# Altium project OBC.PrjPcb
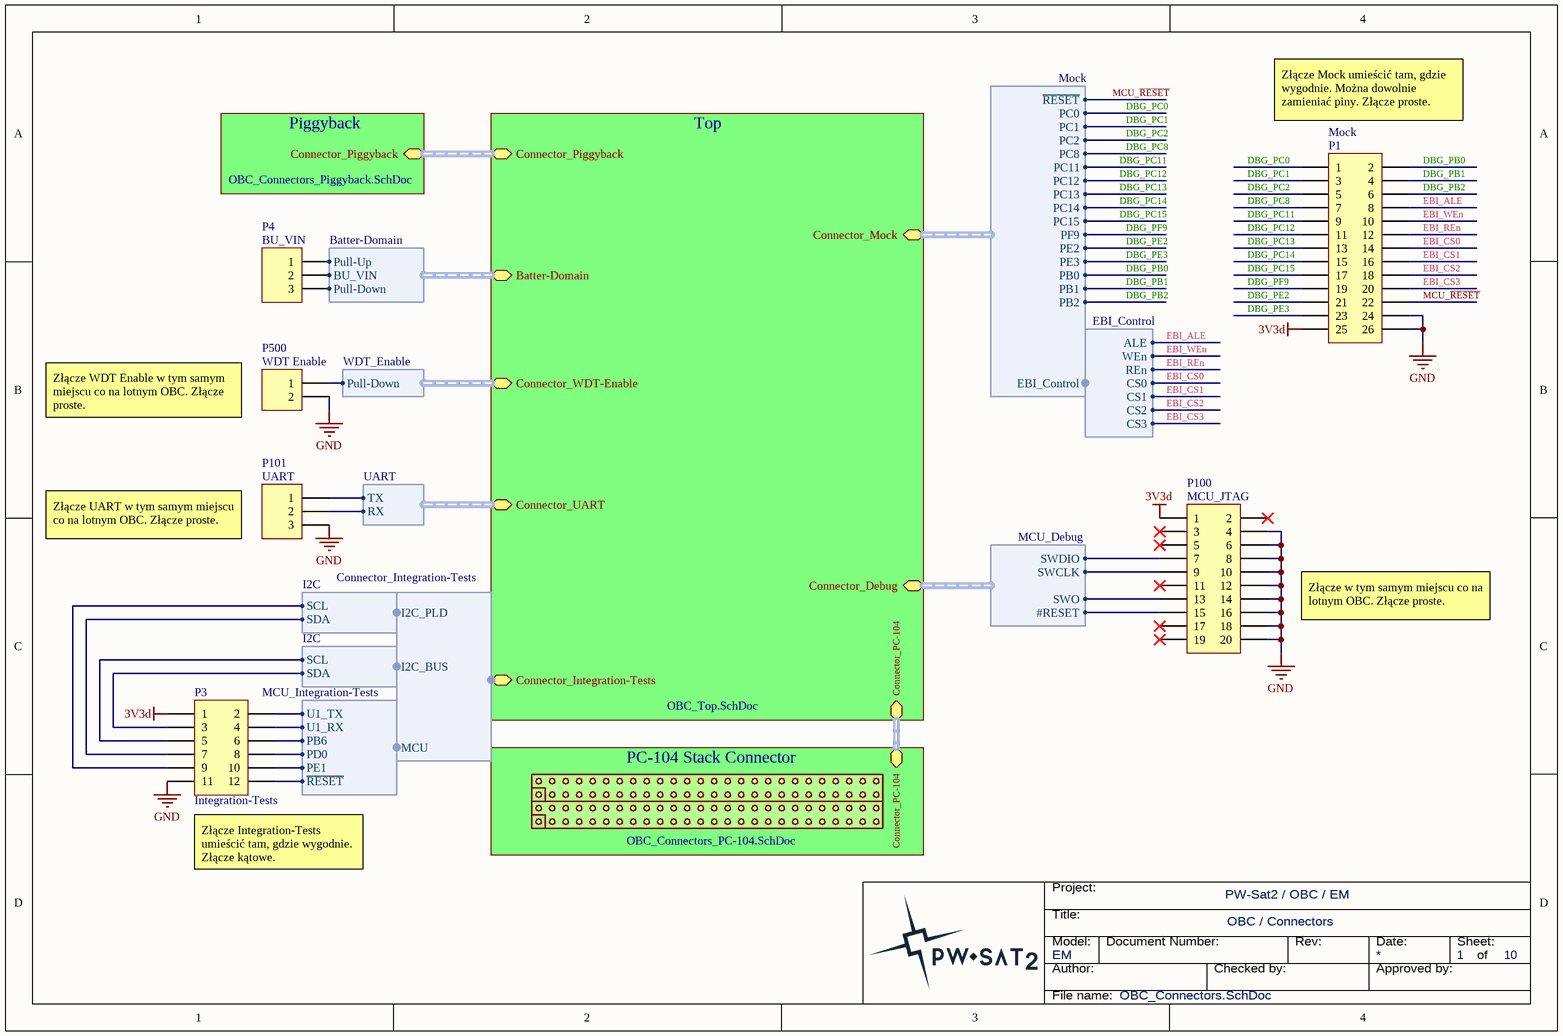
[diagram p0: OBC_Connectors.SchDoc]
Subsystem: OBC; Schematics_Revision: 2; Schematics_DocNo: PWSat2-xxx-DW-xxx; Schematics_DocName: OBC; Project_ShortName: PW-Sat2; Project_FullName: PW-Sat2; PCB_Revision: 2; PCB_DocNo: PWSat2-xxx-DW-xxx; PCB_CheckedBy: (not checked); PCB_Author: (pcbdoc author); Model: EM; Equipment: OBC; CheckedBy_Name: Grzegorz Gajoch; Author_Name: Piotr Kuligowski; ApprovedBy_Name: (not approved)
10 sheets, 98 parts. Net scope: hierarchical (ports join the sheet entries above them; power ports are global).
Board file: OBC.PcbDoc
Sheets:
  OBC_Connectors.SchDoc
    Top = OBC_Top.SchDoc
      EEPROM = OBC_EEPROM.SchDoc
      Flash = OBC_Flash.SchDoc
      SRAM = OBC_SRAM.SchDoc
      MCU = OBC_MCU.SchDoc
      I2C-Repeater = OBC_I2C-Repeater.SchDoc
      I2C-Repeater = OBC_I2C-Repeater.SchDoc
      D-Latch = OBC_EBI_D-Latch.SchDoc
    Piggyback = OBC_Connectors_Piggyback.SchDoc
    PC-104 Stack Connector = OBC_Connectors_PC-104.SchDoc

## Sheet OBC_Connectors.SchDoc: Connectors
size A4; ApprovedBy: (not approved); CheckedBy: Grzegorz Gajoch; Author: Piotr Kuligowski; DocumentNumber: PWSat2-xxx-DW-xxx; Revision: 2; SheetNumber: 1; SheetTotal: 10; Model: EM

### Parts
P1  Mock  [Samtec_TSW-113-07-L-D]
P3  Integration-Tests  [Samtec_TSW-106-07-L-D]
P4  BU_VIN  [Samtec_TSW-103-07-L-S]
P100  MCU_JTAG  [Samtec_TSS-110-01-G-D]
P101  UART  [Samtec_TSW-103-07-L-S]
P500  WDT Enable  [HEADER 1X2 Male]

### Sub-sheets
PC-104 Stack Connector = OBC_Connectors_PC-104.SchDoc: Connector_PC-104 (harness Connector_PC-104)
Piggyback = OBC_Connectors_Piggyback.SchDoc: Connector_Piggyback (harness Connector_Piggyback)
Top = OBC_Top.SchDoc: Connector_UART (harness UART), Connector_PC-104 (harness Connector_PC-104), Connector_Piggyback (harness Connector_Piggyback), Connector_Debug (harness MCU_Debug), Connector_Mock (harness Mock), Connector_Integration-Tests (harness Connector_Integration-Tests), Connector_WDT-Enable (harness WDT_Enable), Batter-Domain (harness Batter-Domain)

### Harnesses
UART: RX, TX
MCU_Debug: SWDIO, SWCLK, SWO, #RESET
Mock: PC14, PC15, PF9, PE2, PE3, PB0, PB1, PB2, EBI_Control, PC0, PC1, PC2, PC8, ~{RESET}, PC11, PC12, PC13
EBI_Control: ALE, WEn, REn, CS0, CS1, CS2, CS3
Connector_Integration-Tests: MCU, I2C_PLD, I2C_BUS
I2C: SDA, SCL
MCU_Integration-Tests: ~{RESET}, PB6, PD0, PE1, U1_TX, U1_RX
WDT_Enable: Pull-Down
Batter-Domain: BU_VIN, Pull-Up, Pull-Down

### Nets
3V3d: P1.25 P3.1 P100.1
GND: P1.24 P1.26 P3.11 P100.4 P100.6 P100.8 P100.10 P100.12 P100.14 P100.16 P100.18 P100.20 P101.3 P500.2
DBG_PB0: P1.2 ; sheet Top/Connector_Mock.PB0
DBG_PB1: P1.4 ; sheet Top/Connector_Mock.PB1
DBG_PB2: P1.6 ; sheet Top/Connector_Mock.PB2
DBG_PC0: P1.1 ; sheet Top/Connector_Mock.PC0
DBG_PC1: P1.3 ; sheet Top/Connector_Mock.PC1
DBG_PC2: P1.5 ; sheet Top/Connector_Mock.PC2
DBG_PC8: P1.7 ; sheet Top/Connector_Mock.PC8
DBG_PC11: P1.9 ; sheet Top/Connector_Mock.PC11
DBG_PC12: P1.11 ; sheet Top/Connector_Mock.PC12
DBG_PC13: P1.13 ; sheet Top/Connector_Mock.PC13
DBG_PC14: P1.15 ; sheet Top/Connector_Mock.PC14
DBG_PC15: P1.17 ; sheet Top/Connector_Mock.PC15
DBG_PE2: P1.21 ; sheet Top/Connector_Mock.PE2
DBG_PE3: P1.23 ; sheet Top/Connector_Mock.PE3
DBG_PF9: P1.19 ; sheet Top/Connector_Mock.PF9
EBI_ALE: P1.8 ; harness EBI_Control.ALE
EBI_CS0: P1.14 ; harness EBI_Control.CS0
EBI_CS1: P1.16 ; harness EBI_Control.CS1
EBI_CS2: P1.18 ; harness EBI_Control.CS2
EBI_CS3: P1.20 ; harness EBI_Control.CS3
EBI_REn: P1.12 ; harness EBI_Control.REn
EBI_WEn: P1.10 ; harness EBI_Control.WEn
GPIO_PD8: P4.2 ; sheet Top/Batter-Domain.BU_VIN
Intergation_PB6: P3.6 ; harness MCU_Integration-Tests.PB6
Intergation_PD0: P3.8 ; harness MCU_Integration-Tests.PD0
Intergation_PE1: P3.10 ; harness MCU_Integration-Tests.PE1
MCU_~{RESET}: P1.22 P3.12 P100.15 ; sheet Top/Connector_Debug.#RESET, sheet Top/Connector_Mock.~{RESET}, harness MCU_Integration-Tests.~{RESET}
MCU_SWCLK: P100.9 ; sheet Top/Connector_Debug.SWCLK
MCU_SWDIO: P100.7 ; sheet Top/Connector_Debug.SWDIO
MCU_SWO: P100.13 ; sheet Top/Connector_Debug.SWO
PC-104_I2C-Bus_SCL: P3.5 ; harness I2C.SCL
PC-104_I2C-Bus_SDA: P3.3 ; harness I2C.SDA
PC-104_I2C-Payload_SCL: P3.9 ; harness I2C.SCL
PC-104_I2C-Payload_SDA: P3.7 ; harness I2C.SDA
U1_RX: P3.4 P101.2 ; sheet Top/Connector_UART.RX, harness MCU_Integration-Tests.U1_RX
U1_TX: P3.2 P101.1 ; sheet Top/Connector_UART.TX, harness MCU_Integration-Tests.U1_TX
NetP4_1: P4.1 ; sheet Top/Batter-Domain.Pull-Up
NetP4_3: P4.3 ; sheet Top/Batter-Domain.Pull-Down
NetP500_1: P500.1 ; sheet Top/Connector_WDT-Enable.Pull-Down

Not connected (* = marked no-connect by the designer): P100 2* 3* 5* 11* 17* 19*

### Buses and harness runs
harness sheet PC-104 Stack Connector/Connector_PC-104 = sheet Top/Connector_PC-104
harness sheet Piggyback/Connector_Piggyback = sheet Top/Connector_Piggyback

### Notes on the sheet
- (near P1) Złącze Mock umieścić tam, gdzie wygodnie. Można dowolnie zamieniać piny. Złącze proste.
- Złącze WDT Enable w tym samym miejscu co na lotnym OBC. Złącze proste.
- Złącze UART w tym samym miejscu co na lotnym OBC. Złącze proste.
- Złącze w tym samym miejscu co na lotnym OBC. Złącze proste.
- (near P3) Złącze Integration-Tests umieścić tam, gdzie wygodnie. Złącze kątowe.
- Title:
- Project:
- Author:
- Model:
- Document Number:
- Checked by:
- Rev:
- Date:
- Approved by:
- Sheet:
- of
- File name:

### Library data of the parts
P1 = Header 13X2: Header, 13-Pin, Dual row; partNo: 67997-426HLF; Manufacturer: Amphenol; Supplier 1: Farnell; Farnell: 1925216
P3 = Header 6X2: Header, 6-Pin, Dual row, Right Angle; partNo: MC34771; Manufacturer: Multicomp; Supplier 1: Farnell; Farnell: 1593452
P4 P101 = Header 3: Header, 3-Pin; partNo: 2211S-03G; Manufacturer: Multicomp; Supplier 1: Farnell; Farnell: 1593412
P100 = Header 10X2: Header, 10-Pin, Dual row; partNo: MC9A12-2034; Manufacturer: 3M; Supplier 1: Farnell; Farnell: 1099258
P500 = Header 2: Header, 2-Pin; Manufacturer: Multicomp; partNo: 2211S-02G; Farnell: 1593411; Supplier 1: Farnell

## Sheet OBC_Top.SchDoc: Top
size A4; ApprovedBy: (not approved); CheckedBy: Grzegorz Gajoch; Author: Piotr Kuligowski; DocumentNumber: PWSat2-xxx-DW-xxx; Revision: 2; SheetNumber: 4; SheetTotal: 10; Model: EM
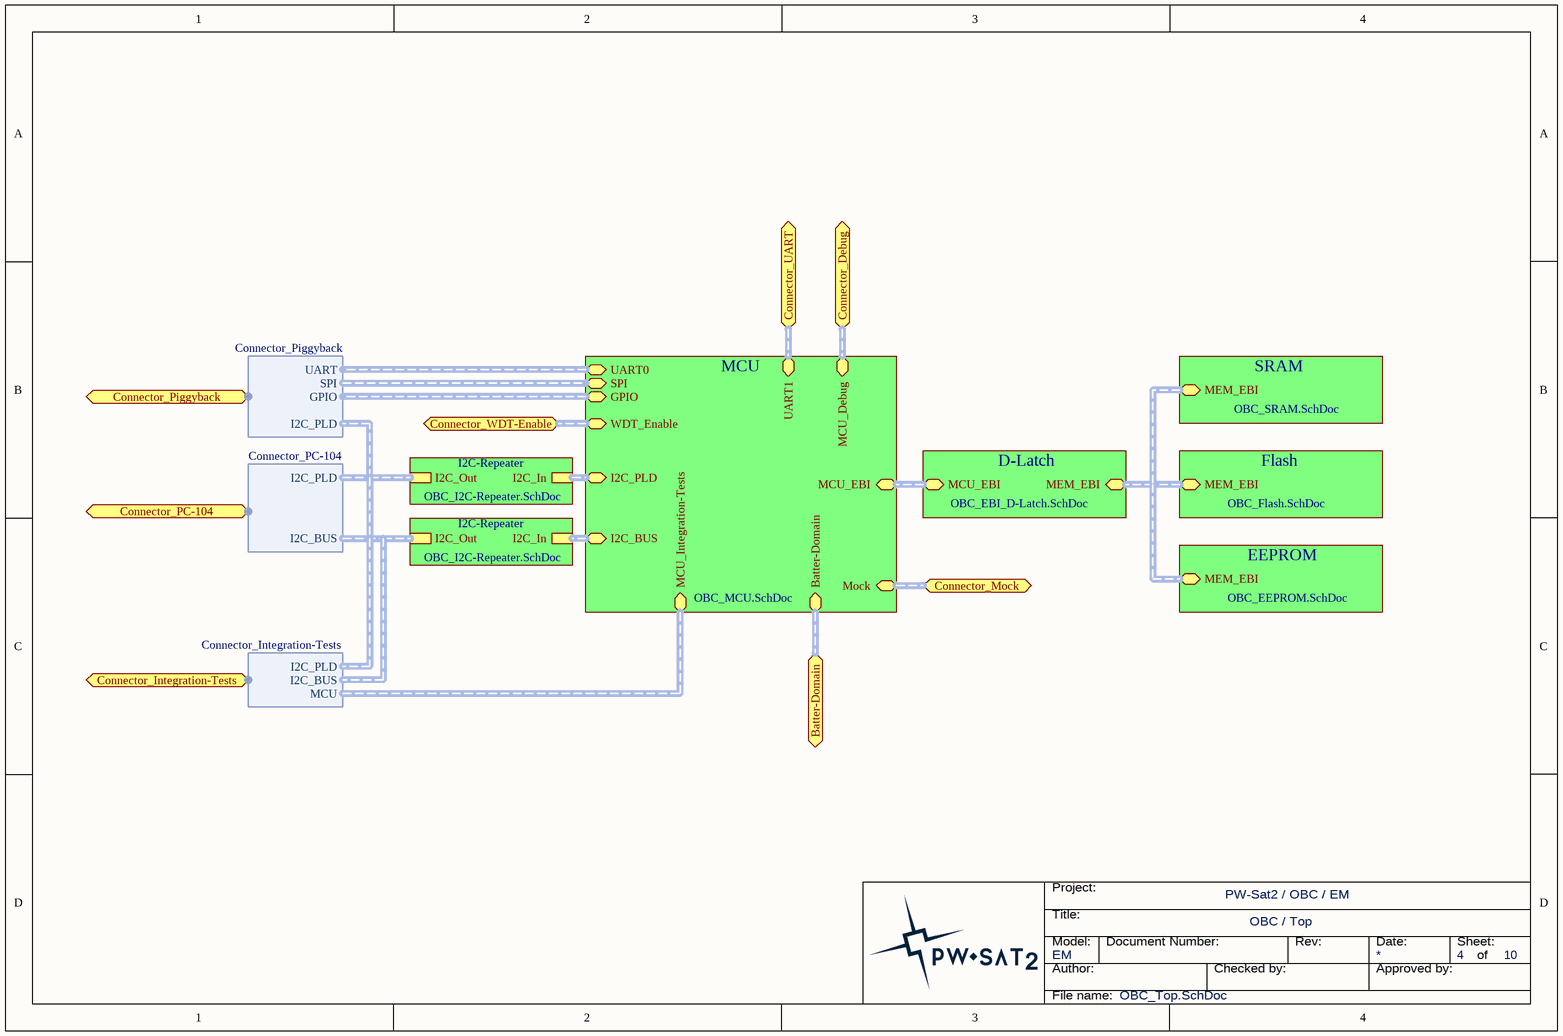
[diagram p1: OBC_Top.SchDoc]

### Sub-sheets
D-Latch = OBC_EBI_D-Latch.SchDoc: MEM_EBI (harness MEM_EBI), MCU_EBI (harness MCU_EBI)
EEPROM = OBC_EEPROM.SchDoc: MEM_EBI (harness MEM_EBI)
Flash = OBC_Flash.SchDoc: MEM_EBI (harness MEM_EBI)
I2C-Repeater = OBC_I2C-Repeater.SchDoc: I2C_Out (harness I2C), I2C_In (harness I2C)
I2C-Repeater = OBC_I2C-Repeater.SchDoc: I2C_Out (harness I2C), I2C_In (harness I2C)
MCU = OBC_MCU.SchDoc: I2C_BUS (harness I2C), I2C_PLD (harness I2C), UART0 (harness UART), SPI (harness SPI), UART1 (harness UART), GPIO (harness GPIO), Mock (harness Mock), MCU_Debug (harness MCU_Debug), MCU_EBI (harness MCU_EBI), MCU_Integration-Tests (harness MCU_Integration-Tests), WDT_Enable (harness WDT_Enable), Batter-Domain (harness Batter-Domain)
SRAM = OBC_SRAM.SchDoc: MEM_EBI (harness MEM_EBI)

### Ports
Batter-Domain (harness Batter-Domain), Connector_Debug (harness MCU_Debug), Connector_Integration-Tests (harness Connector_Integration-Tests), Connector_Mock (harness Mock), Connector_PC-104 (harness Connector_PC-104), Connector_Piggyback (harness Connector_Piggyback), Connector_UART (harness UART), Connector_WDT-Enable (harness WDT_Enable)

### Harnesses
Connector_Piggyback: UART, SPI, I2C_PLD, GPIO
Connector_PC-104: I2C_BUS, I2C_PLD
Connector_Integration-Tests: MCU, I2C_PLD, I2C_BUS

### Buses and harness runs
harness port Batter-Domain = sheet MCU/Batter-Domain
harness port Connector_Debug = sheet MCU/MCU_Debug
harness port Connector_Mock = sheet MCU/Mock
harness port Connector_UART = sheet MCU/UART1
harness port Connector_WDT-Enable = sheet MCU/WDT_Enable
harness sheet D-Latch/MCU_EBI = sheet MCU/MCU_EBI
harness sheet D-Latch/MEM_EBI = sheet EEPROM/MEM_EBI = sheet Flash/MEM_EBI = sheet SRAM/MEM_EBI
harness sheet I2C-Repeater/I2C_In = sheet MCU/I2C_BUS
harness sheet I2C-Repeater/I2C_In = sheet MCU/I2C_PLD

### Notes on the sheet
- Title:
- Project:
- Author:
- Model:
- Document Number:
- Checked by:
- Rev:
- Date:
- Approved by:
- Sheet:
- of
- File name:

## Sheet OBC_EEPROM.SchDoc: EEPROM
size A4; ApprovedBy: (not approved); CheckedBy: Grzegorz Gajoch; Author: Piotr Kuligowski; DocumentNumber: PWSat2-xxx-DW-xxx; Revision: 2; SheetNumber: 10; SheetTotal: 10; Model: EM
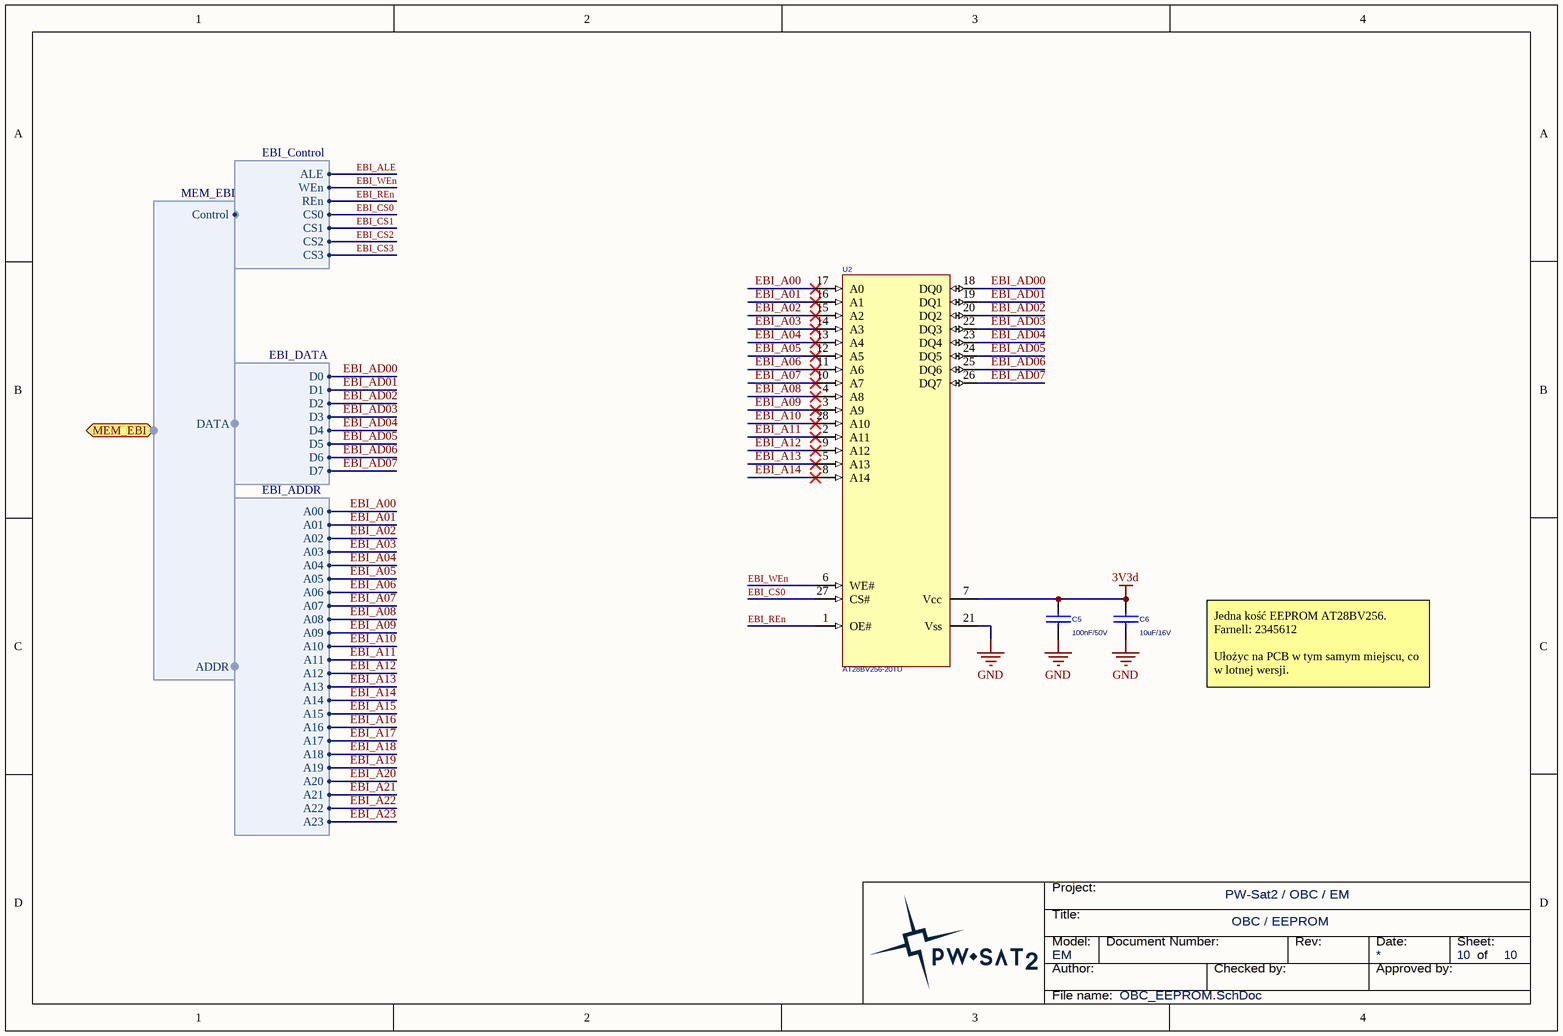
[diagram p2: OBC_EEPROM.SchDoc]

### Parts
C5  100nF/50V  [C0603]
C6  10uF/16V  [C1206]
U2  AT28BV256-20TU  [TSOP-28T]

### Ports
MEM_EBI (harness MEM_EBI)

### Harnesses
EBI_Control: ALE, WEn, REn, CS0, CS1, CS2, CS3
MEM_EBI: DATA, ADDR, Control
EBI_DATA: D6, D5, D4, D3, D2, D1, D0, D7
EBI_ADDR: A09, A10, A11, A12, A13, A14, A15, A08, A16, A17, A18, A19, A20, A21, A22, A23, A00, A01, A02, A03, A04, A05, A06, A07

### Nets
3V3d: C5.1 C6.1 U2.7(Vcc)
GND: C5.2 C6.2 U2.21(Vss)
EBI_A00: U2.17(A0) ; harness EBI_ADDR.A00
EBI_A01: U2.16(A1) ; harness EBI_ADDR.A01
EBI_A02: U2.15(A2) ; harness EBI_ADDR.A02
EBI_A03: U2.14(A3) ; harness EBI_ADDR.A03
EBI_A04: U2.13(A4) ; harness EBI_ADDR.A04
EBI_A05: U2.12(A5) ; harness EBI_ADDR.A05
EBI_A06: U2.11(A6) ; harness EBI_ADDR.A06
EBI_A07: U2.10(A7) ; harness EBI_ADDR.A07
EBI_A08: U2.4(A8) ; harness EBI_ADDR.A08
EBI_A09: U2.3(A9) ; harness EBI_ADDR.A09
EBI_A10: U2.28(A10) ; harness EBI_ADDR.A10
EBI_A11: U2.2(A11) ; harness EBI_ADDR.A11
EBI_A12: U2.9(A12) ; harness EBI_ADDR.A12
EBI_A13: U2.5(A13) ; harness EBI_ADDR.A13
EBI_A14: U2.8(A14) ; harness EBI_ADDR.A14
EBI_AD00: U2.18(DQ0) ; harness EBI_DATA.D0
EBI_AD01: U2.19(DQ1) ; harness EBI_DATA.D1
EBI_AD02: U2.20(DQ2) ; harness EBI_DATA.D2
EBI_AD03: U2.22(DQ3) ; harness EBI_DATA.D3
EBI_AD04: U2.23(DQ4) ; harness EBI_DATA.D4
EBI_AD05: U2.24(DQ5) ; harness EBI_DATA.D5
EBI_AD06: U2.25(DQ6) ; harness EBI_DATA.D6
EBI_AD07: U2.26(DQ7) ; harness EBI_DATA.D7
EBI_CS0: U2.27(CS#) ; harness EBI_Control.CS0
EBI_REn: U2.1(OE#) ; harness EBI_Control.REn
EBI_WEn: U2.6(WE#) ; harness EBI_Control.WEn

### Notes on the sheet
- Jedna kość EEPROM AT28BV256.
  Farnell: 2345612
  Ułożyc na PCB w tym samym miejscu, co w lotnej wersji.
- Title:
- Project:
- Author:
- Model:
- Document Number:
- Checked by:
- Rev:
- Date:
- Approved by:
- Sheet:
- of
- File name:

### Library data of the parts
C5 = CAP: Capacitator; Voltage: 50V; Material: X7R; Value: 100nF; Farnell: 1759122; Supplier Part Number 1: 1759122; Supplier 1: Farnell
C6 = CAP: Capacitator; Voltage: 16V; Material: X5R; Value: 10uF; Farnell: 2320922; Supplier Part Number 1: 2320922; Supplier 1: Farnell
U2 = AT28BV256-20TU: 256K (32K x 8)  Battery-Voltage  Parallel  EEPROMs; Manufacturer: Microchip Technology; partNo: AT28BV256-20TU; DigiKey: AT28BV256-20TU-ND; Supplier 1: Digi-Key

## Sheet OBC_Flash.SchDoc: Flash
size A4; ApprovedBy: (not approved); CheckedBy: Grzegorz Gajoch; Author: Piotr Kuligowski; DocumentNumber: PWSat2-xxx-DW-xxx; Revision: 2; SheetNumber: 9; SheetTotal: 10; Model: EM
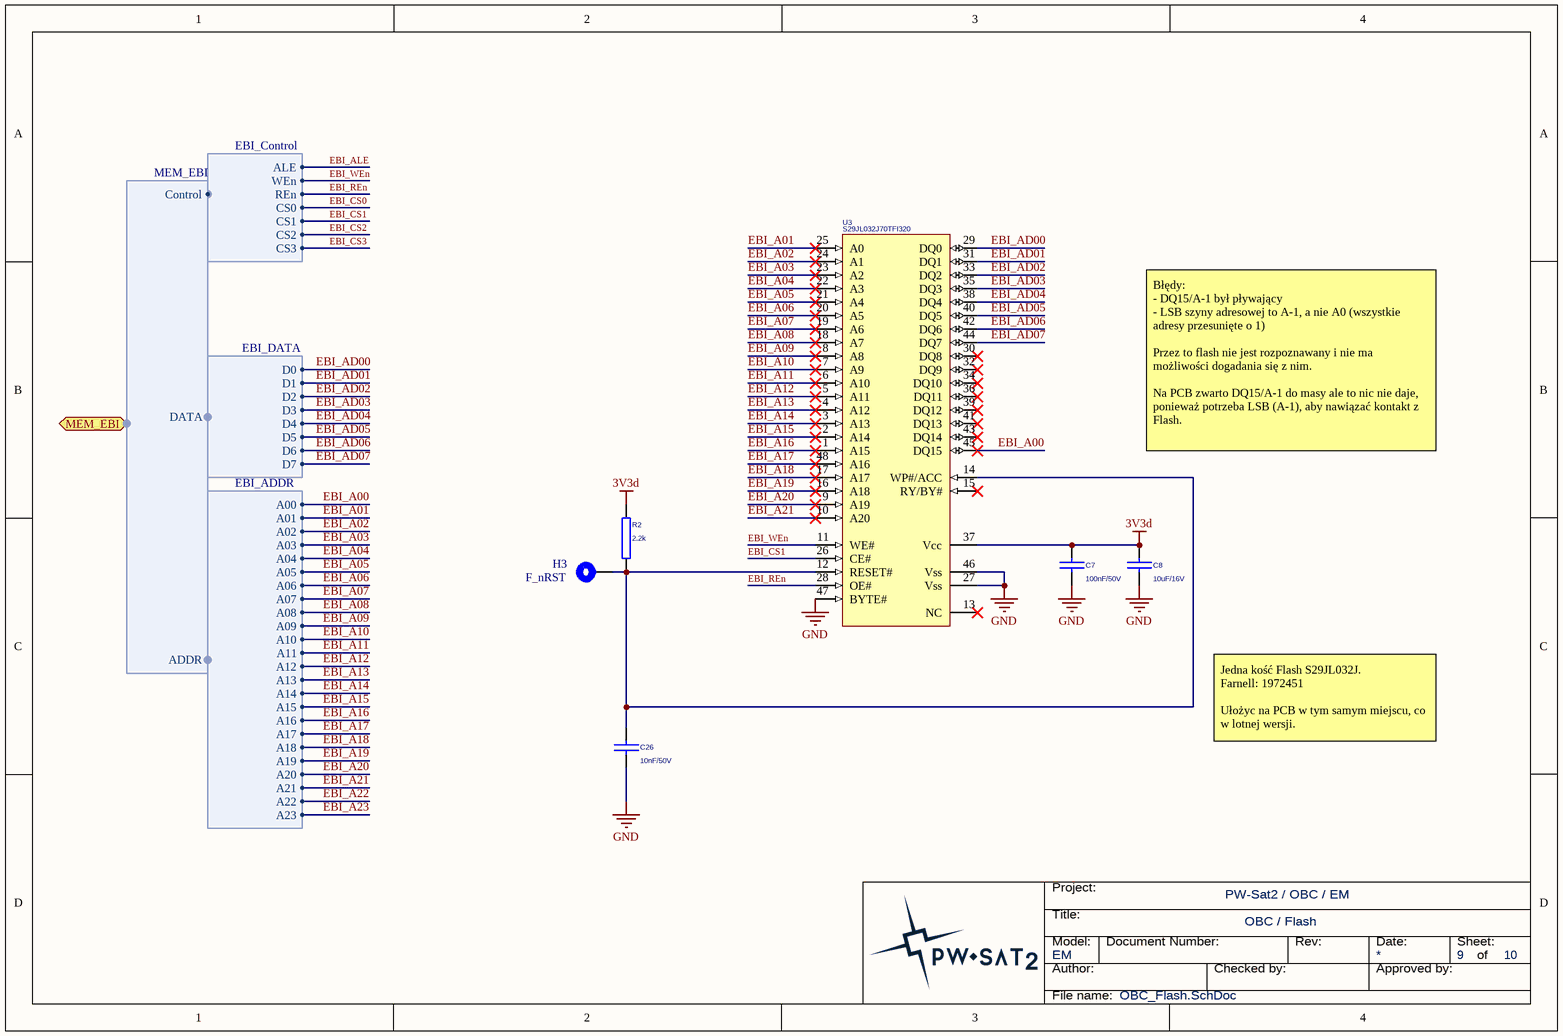
[diagram p3: OBC_Flash.SchDoc]

### Parts
C7  100nF/50V  [C0603]
C8  10uF/16V  [C1206]
C26  10nF/50V  [C0603]
H3  F_nRST  [TESTPOINT]  (no BOM)
R2  2.2k  [R0603]
U3  S29JL032J70TFI320  [TSSOP50P2000X125-48N]

### Ports
MEM_EBI (harness MEM_EBI)

### Harnesses
EBI_Control: ALE, WEn, REn, CS0, CS1, CS2, CS3
MEM_EBI: DATA, ADDR, Control
EBI_DATA: D6, D5, D4, D3, D2, D1, D0, D7
EBI_ADDR: A09, A10, A11, A12, A13, A14, A15, A08, A16, A17, A18, A19, A20, A21, A22, A23, A00, A01, A02, A03, A04, A05, A06, A07

### Nets
3V3d: C7.1 C8.1 R2.2 U3.37(Vcc)
GND: C7.2 C8.2 C26.2 U3.27(Vss) U3.46(Vss) U3.47(BYTE#)
EBI_A00: U3.45(DQ15) ; harness EBI_ADDR.A00
EBI_A01: U3.25(A0) ; harness EBI_ADDR.A01
EBI_A02: U3.24(A1) ; harness EBI_ADDR.A02
EBI_A03: U3.23(A2) ; harness EBI_ADDR.A03
EBI_A04: U3.22(A3) ; harness EBI_ADDR.A04
EBI_A05: U3.21(A4) ; harness EBI_ADDR.A05
EBI_A06: U3.20(A5) ; harness EBI_ADDR.A06
EBI_A07: U3.19(A6) ; harness EBI_ADDR.A07
EBI_A08: U3.18(A7) ; harness EBI_ADDR.A08
EBI_A09: U3.8(A8) ; harness EBI_ADDR.A09
EBI_A10: U3.7(A9) ; harness EBI_ADDR.A10
EBI_A11: U3.6(A10) ; harness EBI_ADDR.A11
EBI_A12: U3.5(A11) ; harness EBI_ADDR.A12
EBI_A13: U3.4(A12) ; harness EBI_ADDR.A13
EBI_A14: U3.3(A13) ; harness EBI_ADDR.A14
EBI_A15: U3.2(A14) ; harness EBI_ADDR.A15
EBI_A16: U3.1(A15) ; harness EBI_ADDR.A16
EBI_A17: U3.48(A16) ; harness EBI_ADDR.A17
EBI_A18: U3.17(A17) ; harness EBI_ADDR.A18
EBI_A19: U3.16(A18) ; harness EBI_ADDR.A19
EBI_A20: U3.9(A19) ; harness EBI_ADDR.A20
EBI_A21: U3.10(A20) ; harness EBI_ADDR.A21
EBI_AD00: U3.29(DQ0) ; harness EBI_DATA.D0
EBI_AD01: U3.31(DQ1) ; harness EBI_DATA.D1
EBI_AD02: U3.33(DQ2) ; harness EBI_DATA.D2
EBI_AD03: U3.35(DQ3) ; harness EBI_DATA.D3
EBI_AD04: U3.38(DQ4) ; harness EBI_DATA.D4
EBI_AD05: U3.40(DQ5) ; harness EBI_DATA.D5
EBI_AD06: U3.42(DQ6) ; harness EBI_DATA.D6
EBI_AD07: U3.44(DQ7) ; harness EBI_DATA.D7
EBI_CS1: U3.26(CE#) ; harness EBI_Control.CS1
EBI_REn: U3.28(OE#) ; harness EBI_Control.REn
EBI_WEn: U3.11(WE#) ; harness EBI_Control.WEn
NetC26_1: C26.1 H3.1 R2.1 U3.12(RESET#) U3.14(WP#/ACC)

Not connected (* = marked no-connect by the designer): U3 13(NC)* 15(RY/BY#)* 30(DQ8)* 32(DQ9)* 34(DQ10)* 36(DQ11)* 39(DQ12)* 41(DQ13)* 43(DQ14)*

### Notes on the sheet
- Błędy:
  - DQ15/A-1 był pływający
  - LSB szyny adresowej to A-1, a nie A0 (wszystkie adresy przesunięte o 1)
  Przez to flash nie jest rozpoznawany i nie ma możliwości dogadania się z nim.
  Na PCB zwarto DQ15/A-1 do masy ale to nic nie daje, ponieważ potrzeba LSB (A-1), aby nawiązać kontakt z Flash.
- Jedna kość Flash S29JL032J.
  Farnell: 1972451
  Ułożyc na PCB w tym samym miejscu, co w lotnej wersji.
- Title:
- Project:
- Author:
- Model:
- Document Number:
- Checked by:
- Rev:
- Date:
- Approved by:
- Sheet:
- of
- File name:

### Library data of the parts
C7 = CAP: as C5 on sheet OBC_EEPROM; Farnell: 1759122; Supplier Part Number 1: 1759122; Supplier 1: Farnell
C8 = CAP: as C6 on sheet OBC_EEPROM; Farnell: 2320922; Supplier Part Number 1: 2320922; Supplier 1: Farnell
C26 = CAP: Capacitator; Voltage: 50V; Material: X7R; Value: 10nF; Farnell: 9406182; Supplier Part Number 1: 9406182; Supplier 1: Farnell
H3 = Wire_AWG-30: An AWG-30 wire solder point.
R2 = RES: Resistor; Tolerance: 1%; Farnell: 9330810; Value: 2.2k; Supplier Part Number 1: 9330810; Supplier 1: Farnell
U3 = S29JL032J: IC FLASH 32MBIT 70NS 48TSOP; Manufacturer: Cypress Semiconductor; partNo: S29JL032J70TFI320; DigiKey: S29JL032J70TFI320-ND; Supplier 1: Digi-Key

## Sheet OBC_SRAM.SchDoc: SRAM
size A4; ApprovedBy: (not approved); CheckedBy: Grzegorz Gajoch; Author: Piotr Kuligowski; DocumentNumber: PWSat2-xxx-DW-xxx; Revision: 2; SheetNumber: 8; SheetTotal: 10; Model: EM
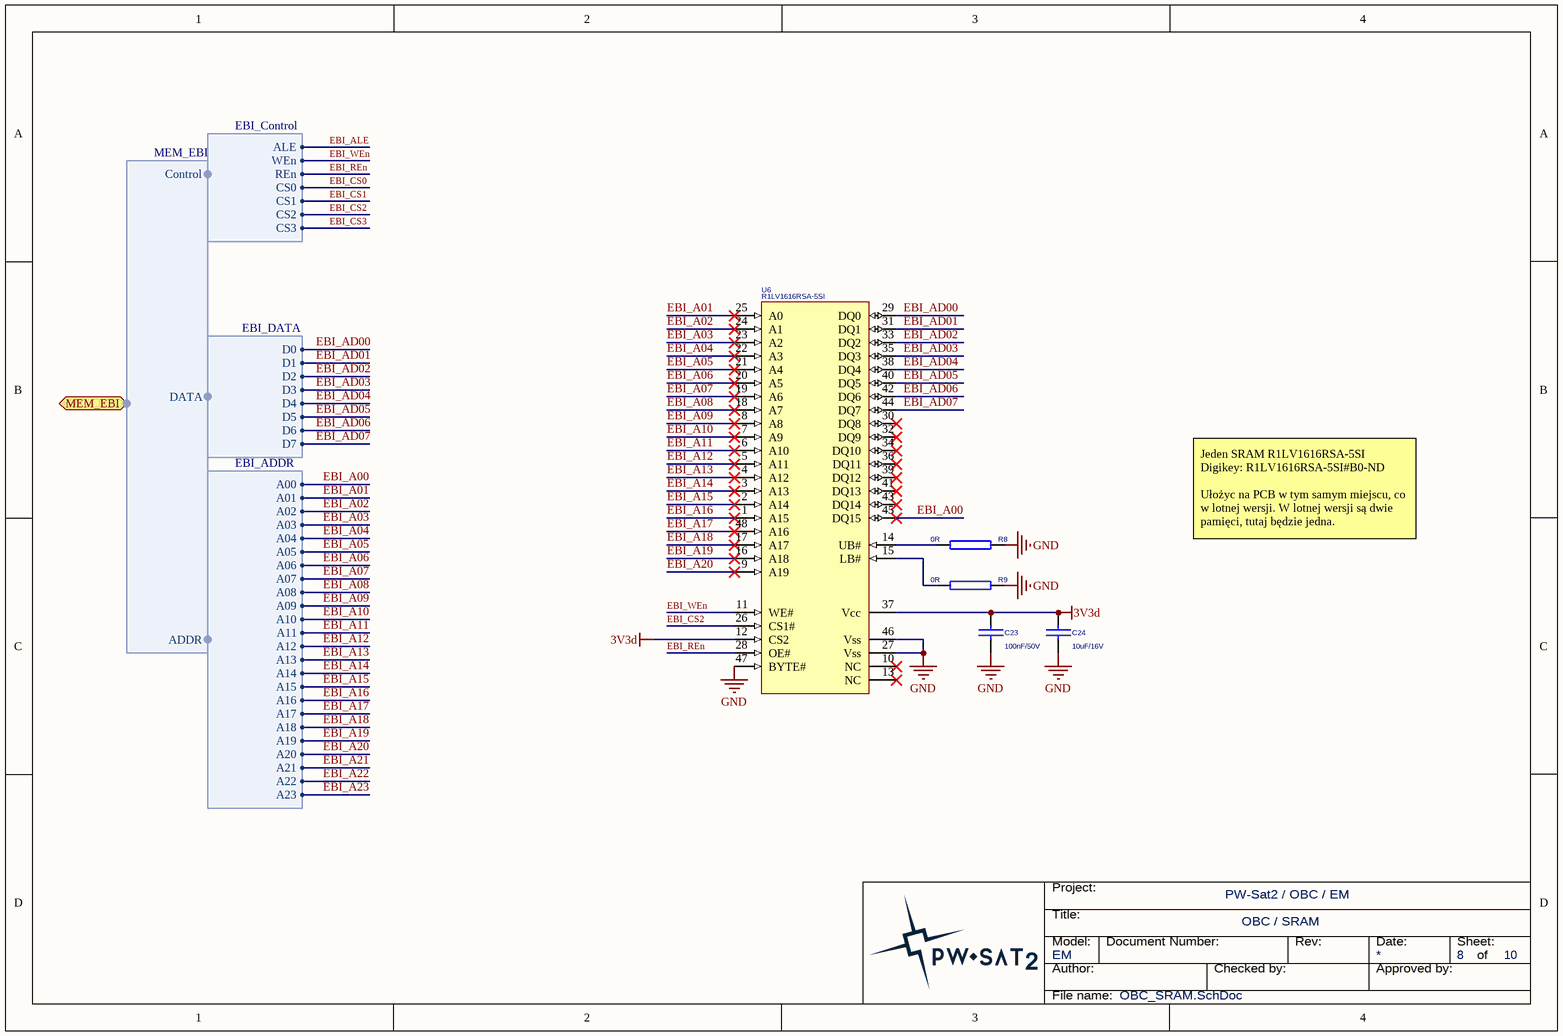
[diagram p4: OBC_SRAM.SchDoc]

### Parts
C23  100nF/50V  [C0603]
C24  10uF/16V  [C1206]
R8  0R  [R0603]
R9  0R  [R0603]
U6  R1LV1616RSA-5SI  [TSSOP50P2000X125-48N]

### Ports
MEM_EBI (harness MEM_EBI)

### Harnesses
MEM_EBI: DATA, ADDR, Control
EBI_Control: ALE, WEn, REn, CS0, CS1, CS2, CS3
EBI_ADDR: A09, A10, A11, A12, A13, A14, A15, A08, A16, A17, A18, A19, A20, A21, A22, A23, A00, A01, A02, A03, A04, A05, A06, A07
EBI_DATA: D6, D5, D4, D3, D2, D1, D0, D7

### Nets
3V3d: C23.1 C24.1 U6.12(CS2) U6.37(Vcc)
GND: C23.2 C24.2 R8.2 R9.2 U6.27(Vss) U6.46(Vss) U6.47(BYTE#)
EBI_A00: U6.45(DQ15) ; harness EBI_ADDR.A00
EBI_A01: U6.25(A0) ; harness EBI_ADDR.A01
EBI_A02: U6.24(A1) ; harness EBI_ADDR.A02
EBI_A03: U6.23(A2) ; harness EBI_ADDR.A03
EBI_A04: U6.22(A3) ; harness EBI_ADDR.A04
EBI_A05: U6.21(A4) ; harness EBI_ADDR.A05
EBI_A06: U6.20(A5) ; harness EBI_ADDR.A06
EBI_A07: U6.19(A6) ; harness EBI_ADDR.A07
EBI_A08: U6.18(A7) ; harness EBI_ADDR.A08
EBI_A09: U6.8(A8) ; harness EBI_ADDR.A09
EBI_A10: U6.7(A9) ; harness EBI_ADDR.A10
EBI_A11: U6.6(A10) ; harness EBI_ADDR.A11
EBI_A12: U6.5(A11) ; harness EBI_ADDR.A12
EBI_A13: U6.4(A12) ; harness EBI_ADDR.A13
EBI_A14: U6.3(A13) ; harness EBI_ADDR.A14
EBI_A15: U6.2(A14) ; harness EBI_ADDR.A15
EBI_A16: U6.1(A15) ; harness EBI_ADDR.A16
EBI_A17: U6.48(A16) ; harness EBI_ADDR.A17
EBI_A18: U6.17(A17) ; harness EBI_ADDR.A18
EBI_A19: U6.16(A18) ; harness EBI_ADDR.A19
EBI_A20: U6.9(A19) ; harness EBI_ADDR.A20
EBI_AD00: U6.29(DQ0) ; harness EBI_DATA.D0
EBI_AD01: U6.31(DQ1) ; harness EBI_DATA.D1
EBI_AD02: U6.33(DQ2) ; harness EBI_DATA.D2
EBI_AD03: U6.35(DQ3) ; harness EBI_DATA.D3
EBI_AD04: U6.38(DQ4) ; harness EBI_DATA.D4
EBI_AD05: U6.40(DQ5) ; harness EBI_DATA.D5
EBI_AD06: U6.42(DQ6) ; harness EBI_DATA.D6
EBI_AD07: U6.44(DQ7) ; harness EBI_DATA.D7
EBI_CS2: U6.26(CS1#) ; harness EBI_Control.CS2
EBI_REn: U6.28(OE#) ; harness EBI_Control.REn
EBI_WEn: U6.11(WE#) ; harness EBI_Control.WEn
NetR8_1: R8.1 U6.14(UB#)
NetR9_1: R9.1 U6.15(LB#)

Not connected (* = marked no-connect by the designer): U6 10(NC)* 13(NC)* 30(DQ8)* 32(DQ9)* 34(DQ10)* 36(DQ11)* 39(DQ12)* 41(DQ13)* 43(DQ14)*

### Notes on the sheet
- Jeden SRAM R1LV1616RSA-5SI
  Digikey: R1LV1616RSA-5SI#B0-ND
  Ułożyc na PCB w tym samym miejscu, co w lotnej wersji. W lotnej wersji są dwie pamięci, tutaj będzie jedna.
- Title:
- Project:
- Author:
- Model:
- Document Number:
- Checked by:
- Rev:
- Date:
- Approved by:
- Sheet:
- of
- File name:

### Library data of the parts
C23 = CAP: as C5 on sheet OBC_EEPROM; Farnell: 1759122; Supplier Part Number 1: 1759122; Supplier 1: Farnell
C24 = CAP: as C6 on sheet OBC_EEPROM; Farnell: 2320922; Supplier Part Number 1: 2320922; Supplier 1: Farnell
R8 R9 = RES: Resistor; Farnell: 2447060; Value: 0R; Supplier Part Number 1: 2447060; Supplier 1: Farnell
U6 = R1LV1616RSA-5SI: IC SRAM 16MBIT 55NS 48TSOP; Manufacturer: Renesas Electronics; partNo: R1LV1616RSA-5SI; DigiKey: R1LV1616RSA-5SI#B0-ND; Supplier 1: Digi-Key

## Sheet OBC_MCU.SchDoc: MCU
size A3; ApprovedBy: (not approved); CheckedBy: Grzegorz Gajoch; Author: Piotr Kuligowski; DocumentNumber: PWSat2-xxx-DW-xxx; Revision: 2; SheetNumber: 5; SheetTotal: 10; Model: EM
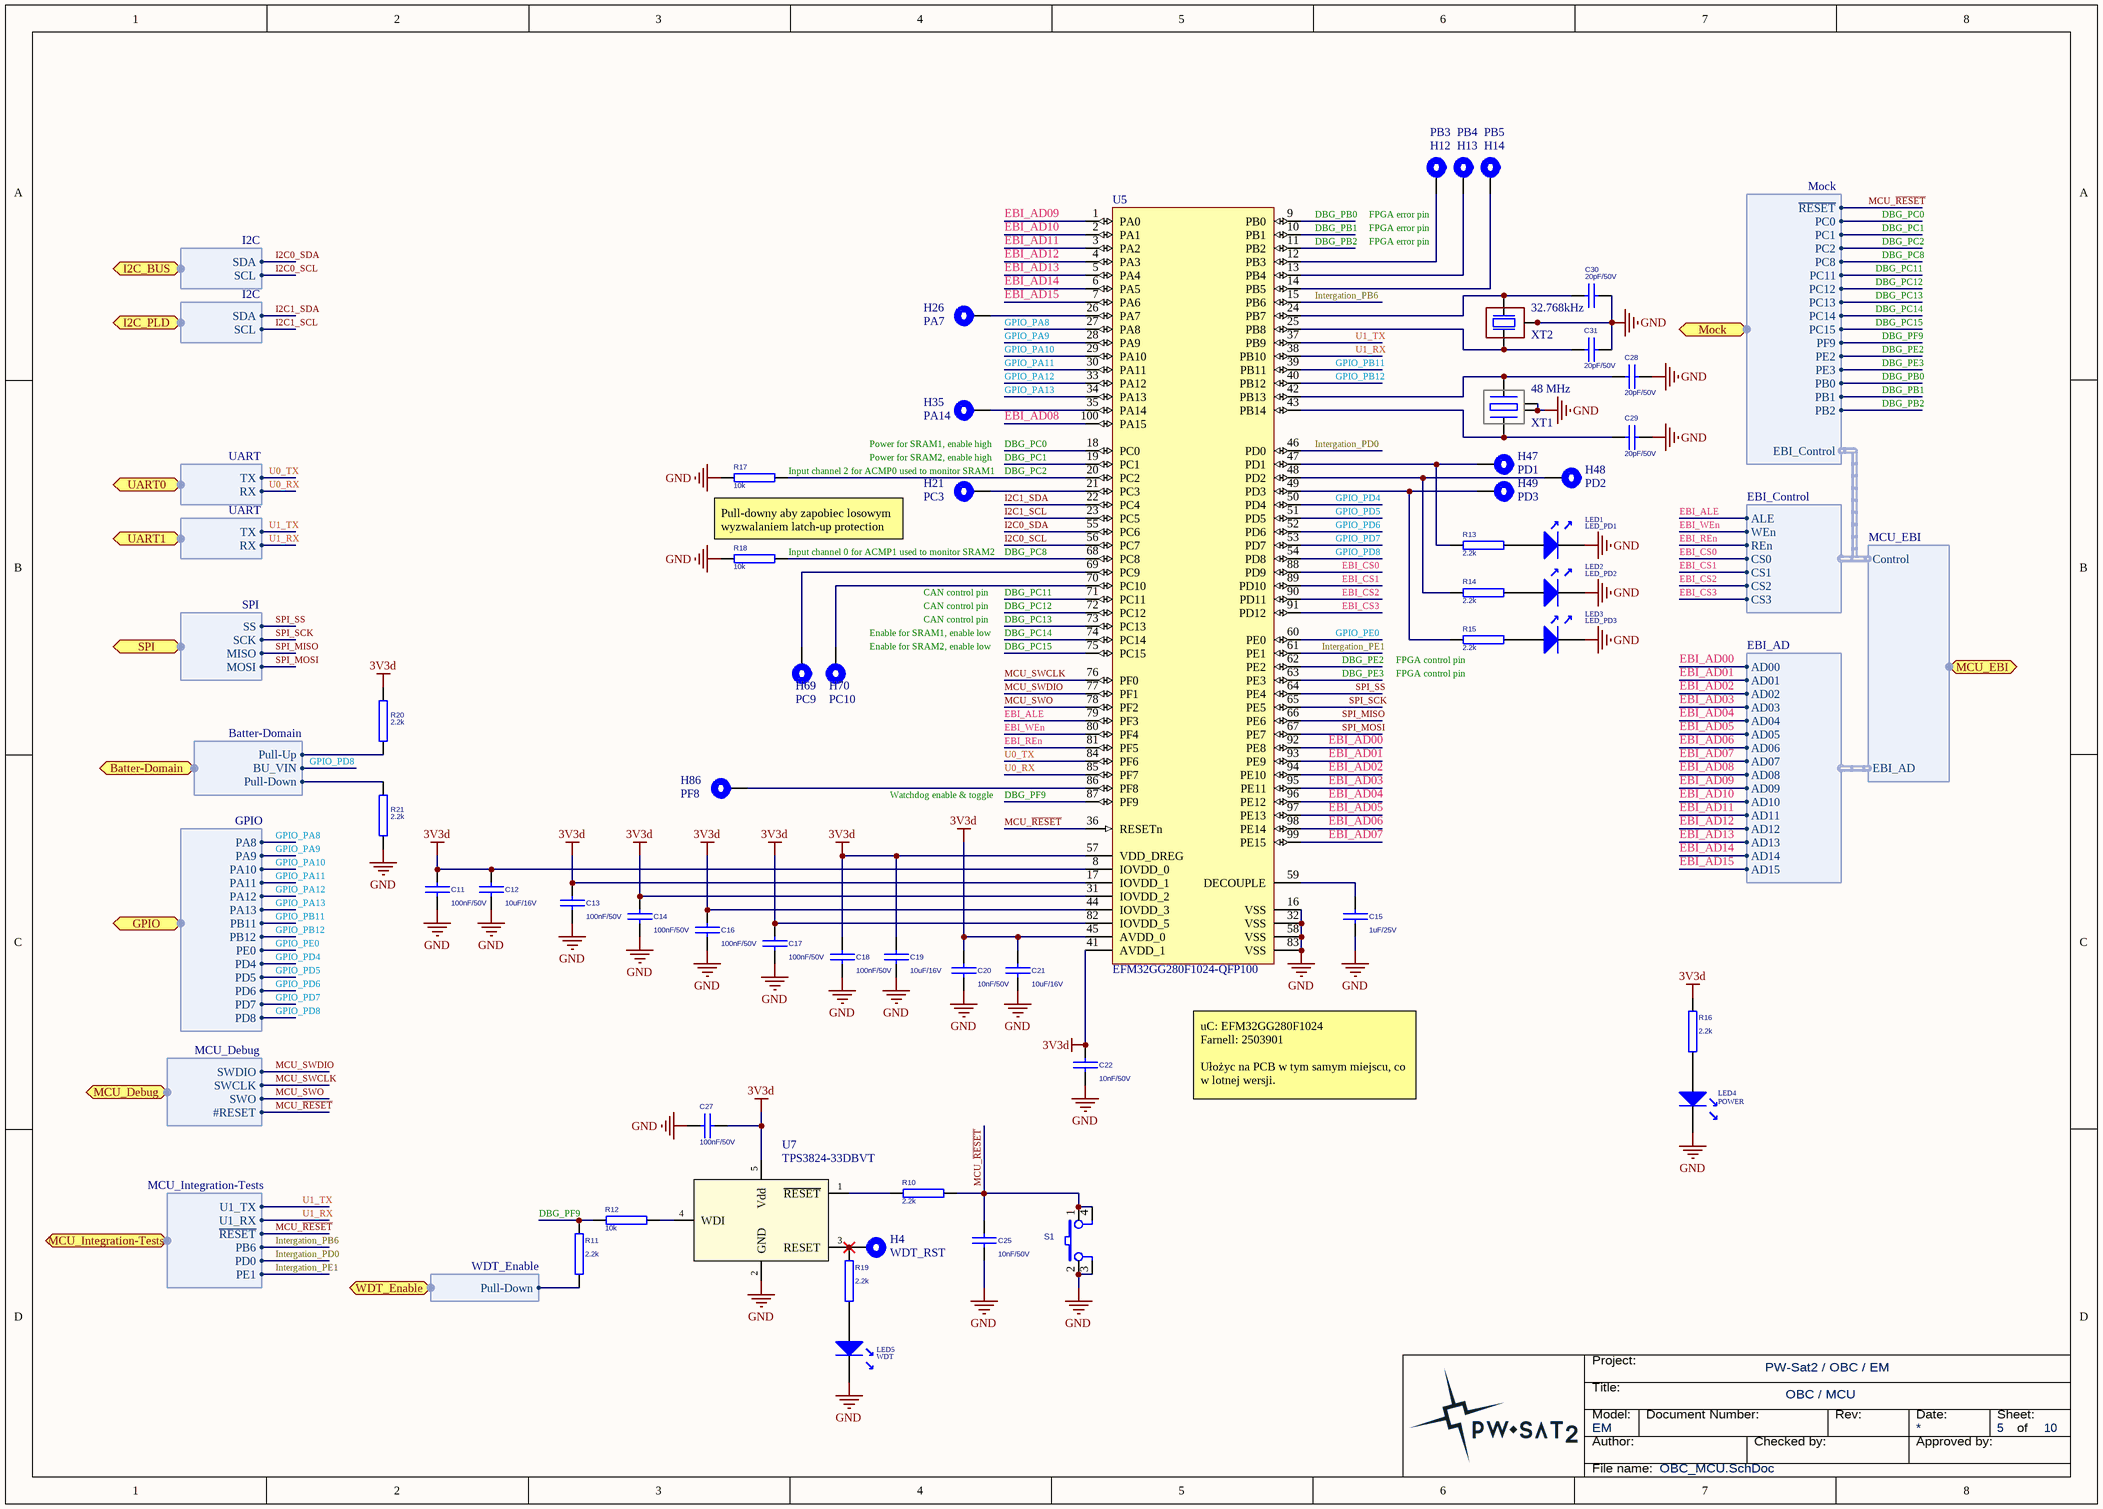
[diagram p5: OBC_MCU.SchDoc]

### Parts
C11  100nF/50V  [C0603]
C12  10uF/16V  [C1206]
C13  100nF/50V  [C0603]
C14  100nF/50V  [C0603]
C15  1uF/25V  [C1206]
C16  100nF/50V  [C0603]
C17  100nF/50V  [C0603]
C18  100nF/50V  [C0603]
C19  10uF/16V  [C1206]
C20  10nF/50V  [C0603]
C21  10uF/16V  [C1206]
C22  10nF/50V  [C0603]
C25  10nF/50V  [C0603]
C27  100nF/50V  [C0603]
C28  20pF/50V  [C0603]
C29  20pF/50V  [C0603]
C30  20pF/50V  [C0603]
C31  20pF/50V  [C0603]
H4  WDT_RST  [TESTPOINT]  (no BOM)
H12  PB3  [TESTPOINT]  (no BOM)
H13  PB4  [TESTPOINT]  (no BOM)
H14  PB5  [TESTPOINT]  (no BOM)
H21  PC3  [TESTPOINT]  (no BOM)
H26  PA7  [TESTPOINT]  (no BOM)
H35  PA14  [TESTPOINT]  (no BOM)
H47  PD1  [TESTPOINT]  (no BOM)
H48  PD2  [TESTPOINT]  (no BOM)
H49  PD3  [TESTPOINT]  (no BOM)
H69  PC9  [TESTPOINT]  (no BOM)
H70  PC10  [TESTPOINT]  (no BOM)
H86  PF8  [TESTPOINT]  (no BOM)
LED1  LED_PD1  [SMD_LED_1206]
LED2  LED_PD2  [SMD_LED_1206]
LED3  LED_PD3  [SMD_LED_1206]
LED4  POWER  [SMD_LED_1206]
LED5  WDT  [SMD_LED_1206]
R10  2.2k  [R0603]
R11  2.2k  [R0603]
R12  10k  [R0603]
R13  2.2k  [R0603]
R14  2.2k  [R0603]
R15  2.2k  [R0603]
R16  2.2k  [R0603]
R17  10k  [R0603]
R18  10k  [R0603]
R19  2.2k  [R0603]
R20  2.2k  [R0603]
R21  2.2k  [R0603]
S1  MC32882  [MC32882]  (value not drawn)
U5  EFM32GG280F1024-QFP100  [ENMR-LQFP100_L]
U7  TPS3824-33DBVT  [SOT23-5]
XT1  48 MHz  [SMD, 5mm x 3.2mm]
XT2  32.768kHz  [Epson_MC-306]

### Ports
Batter-Domain (harness Batter-Domain), GPIO (harness GPIO), I2C_BUS (harness I2C), I2C_PLD (harness I2C), MCU_Debug (harness MCU_Debug), MCU_EBI (harness MCU_EBI), MCU_Integration-Tests (harness MCU_Integration-Tests), Mock (harness Mock), SPI (harness SPI), UART0 (harness UART), UART1 (harness UART), WDT_Enable (harness WDT_Enable)

### Harnesses
I2C: SDA, SCL
MCU_EBI: EBI_AD, Control
EBI_AD: AD09, AD10, AD11, AD12, AD13, AD14, AD15, AD00, AD01, AD02, AD03, AD04, AD05, AD06, AD07, AD08
Mock: PC14, PC15, PF9, PE2, PE3, PB0, PB1, PB2, EBI_Control, PC0, PC1, PC2, PC8, ~{RESET}, PC11, PC12, PC13
UART: RX, TX
SPI: MISO, MOSI, SCK, SS
GPIO: PA8, PA9, PA10, PA11, PA12, PA13, PB11, PB12, PE0, PD4, PD5, PD6, PD7, PD8
EBI_Control: ALE, WEn, REn, CS0, CS1, CS2, CS3
MCU_Debug: SWDIO, SWCLK, SWO, #RESET
MCU_Integration-Tests: ~{RESET}, PB6, PD0, PE1, U1_TX, U1_RX
WDT_Enable: Pull-Down
Batter-Domain: BU_VIN, Pull-Up, Pull-Down

### Nets
3V3d: C11.1 C12.1 C13.1 C14.1 C16.1 C17.1 C18.1 C19.1 C20.1 C21.1 C22.1 C27.2 R16.2 R20.1 U5.8(IOVDD_0) U5.17(IOVDD_1) U5.31(IOVDD_2) U5.41(AVDD_1) U5.44(IOVDD_3) U5.45(AVDD_0) U5.57(VDD_DREG) U5.82(IOVDD_5) U7.5(Vdd)
GND: C11.2 C12.2 C13.2 C14.2 C15.2 C16.2 C17.2 C18.2 C19.2 C20.2 C21.2 C22.2 C25.2 C27.1 C28.2 C29.2 C30.1 C31.2 LED1.K LED2.K LED3.K LED4.K LED5.K R17.2 R18.2 R21.2 S1.2 S1.3 U5.16(VSS) U5.32(VSS) U5.58(VSS) U5.83(VSS) U7.2(GND) XT1.3(GND) XT1.4(GND) XT2.2(NC) XT2.3(NC)
DBG_PB0: U5.9(PB0) ; port Mock.PB0
DBG_PB1: U5.10(PB1) ; port Mock.PB1
DBG_PB2: U5.11(PB2) ; port Mock.PB2
DBG_PC0: U5.18(PC0) ; port Mock.PC0
DBG_PC1: U5.19(PC1) ; port Mock.PC1
DBG_PC2: R17.1 U5.20(PC2) ; port Mock.PC2
DBG_PC8: R18.1 U5.68(PC8) ; port Mock.PC8
DBG_PC11: U5.71(PC11) ; port Mock.PC11
DBG_PC12: U5.72(PC12) ; port Mock.PC12
DBG_PC13: U5.73(PC13) ; port Mock.PC13
DBG_PC14: U5.74(PC14) ; port Mock.PC14
DBG_PC15: U5.75(PC15) ; port Mock.PC15
DBG_PE2: U5.62(PE2) ; port Mock.PE2
DBG_PE3: U5.63(PE3) ; port Mock.PE3
DBG_PF9: R11.2 R12.2 U5.87(PF9) ; port Mock.PF9
EBI_AD00: U5.92(PE8) ; harness EBI_AD.AD00
EBI_AD01: U5.93(PE9) ; harness EBI_AD.AD01
EBI_AD02: U5.94(PE10) ; harness EBI_AD.AD02
EBI_AD03: U5.95(PE11) ; harness EBI_AD.AD03
EBI_AD04: U5.96(PE12) ; harness EBI_AD.AD04
EBI_AD05: U5.97(PE13) ; harness EBI_AD.AD05
EBI_AD06: U5.98(PE14) ; harness EBI_AD.AD06
EBI_AD07: U5.99(PE15) ; harness EBI_AD.AD07
EBI_AD08: U5.100(PA15) ; harness EBI_AD.AD08  [project net EBI_A00]
EBI_AD09: U5.1(PA0) ; harness EBI_AD.AD09  [project net EBI_A01]
EBI_AD10: U5.2(PA1) ; harness EBI_AD.AD10  [project net EBI_A02]
EBI_AD11: U5.3(PA2) ; harness EBI_AD.AD11  [project net EBI_A03]
EBI_AD12: U5.4(PA3) ; harness EBI_AD.AD12  [project net EBI_A04]
EBI_AD13: U5.5(PA4) ; harness EBI_AD.AD13  [project net EBI_A05]
EBI_AD14: U5.6(PA5) ; harness EBI_AD.AD14  [project net EBI_A06]
EBI_AD15: U5.7(PA6) ; harness EBI_AD.AD15  [project net EBI_A07]
EBI_ALE: U5.79(PF3) ; harness EBI_Control.ALE
EBI_CS0: U5.88(PD9) ; harness EBI_Control.CS0
EBI_CS1: U5.89(PD10) ; harness EBI_Control.CS1
EBI_CS2: U5.90(PD11) ; harness EBI_Control.CS2
EBI_CS3: U5.91(PD12) ; harness EBI_Control.CS3
EBI_REn: U5.81(PF5) ; harness EBI_Control.REn
EBI_WEn: U5.80(PF4) ; harness EBI_Control.WEn
GPIO_PA8: U5.27(PA8) ; port GPIO.PA8
GPIO_PA9: U5.28(PA9) ; port GPIO.PA9
GPIO_PA10: U5.29(PA10) ; port GPIO.PA10
GPIO_PA11: U5.30(PA11) ; port GPIO.PA11
GPIO_PA12: U5.33(PA12) ; port GPIO.PA12
GPIO_PA13: U5.34(PA13) ; port GPIO.PA13
GPIO_PB11: U5.39(PB11) ; port GPIO.PB11
GPIO_PB12: U5.40(PB12) ; port GPIO.PB12
GPIO_PD4: U5.50(PD4) ; port GPIO.PD4
GPIO_PD5: U5.51(PD5) ; port GPIO.PD5
GPIO_PD6: U5.52(PD6) ; port GPIO.PD6
GPIO_PD7: U5.53(PD7) ; port GPIO.PD7
GPIO_PD8: U5.54(PD8) ; port GPIO.PD8, port Batter-Domain.BU_VIN
GPIO_PE0: U5.60(PE0) ; port GPIO.PE0
I2C0_SCL: U5.56(PC7) ; port I2C_BUS.SCL
I2C0_SDA: U5.55(PC6) ; port I2C_BUS.SDA
I2C1_SCL: U5.23(PC5) ; port I2C_PLD.SCL
I2C1_SDA: U5.22(PC4) ; port I2C_PLD.SDA
Intergation_PB6: U5.15(PB6) ; port MCU_Integration-Tests.PB6
Intergation_PD0: U5.46(PD0) ; port MCU_Integration-Tests.PD0
Intergation_PE1: U5.61(PE1) ; port MCU_Integration-Tests.PE1
MCU_~{RESET}: C25.1 R10.1 S1.1 S1.4 U5.36(RESETn) ; port Mock.~{RESET}, port MCU_Debug.#RESET, port MCU_Integration-Tests.~{RESET}
MCU_SWCLK: U5.76(PF0) ; port MCU_Debug.SWCLK
MCU_SWDIO: U5.77(PF1) ; port MCU_Debug.SWDIO
MCU_SWO: U5.78(PF2) ; port MCU_Debug.SWO
SPI_MISO: U5.66(PE6) ; port SPI.MISO  [project net PE6]
SPI_MOSI: U5.67(PE7) ; port SPI.MOSI  [project net PE7]
SPI_SCK: U5.65(PE5) ; port SPI.SCK  [project net PE5]
SPI_SS: U5.64(PE4) ; port SPI.SS  [project net PE4]
U0_RX: U5.85(PF7) ; port UART0.RX  [project net PF7]
U0_TX: U5.84(PF6) ; port UART0.TX  [project net PF6]
U1_RX: U5.38(PB10) ; port UART1.RX, port MCU_Integration-Tests.U1_RX
U1_TX: U5.37(PB9) ; port UART1.TX, port MCU_Integration-Tests.U1_TX
NetC15_1: C15.1 U5.59(DECOUPLE)
NetC28_1: C28.1 U5.42(PB13) XT1.2(out)
NetC29_1: C29.1 U5.43(PB14) XT1.1(inp)
NetC30_2: C30.2 U5.24(PB7) XT2.4(out)
NetC31_1: C31.1 U5.25(PB8) XT2.1(inp)
NetH4_1: H4.1 R19.2 U7.3(RESET)
NetH12_1: H12.1 U5.12(PB3)
NetH13_1: H13.1 U5.13(PB4)
NetH14_1: H14.1 U5.14(PB5)
NetH21_1: H21.1 U5.21(PC3)
NetH26_1: H26.1 U5.26(PA7)
NetH35_1: H35.1 U5.35(PA14)
NetH47_1: H47.1 R13.2 U5.47(PD1)
NetH48_1: H48.1 R14.2 U5.48(PD2)
NetH49_1: H49.1 R15.2 U5.49(PD3)
NetH69_1: H69.1 U5.69(PC9)
NetH70_1: H70.1 U5.70(PC10)
NetH86_1: H86.1 U5.86(PF8)
NetLED1_A: LED1.A R13.1
NetLED2_A: LED2.A R14.1
NetLED3_A: LED3.A R15.1
NetLED4_A: LED4.A R16.1
NetLED5_A: LED5.A R19.1
NetP4_1: R20.2 ; port Batter-Domain.Pull-Up
NetP4_3: R21.1 ; port Batter-Domain.Pull-Down
NetP500_1: R11.1 ; port WDT_Enable.Pull-Down
NetR10_2: R10.2 U7.1(~{RESET})
NetR12_1: R12.1 U7.4(WDI)

### Notes on the sheet
- FPGA error pin
- Power for SRAM1, enable high
- Input channel 2 for ACMP0 used to monitor SRAM1
- Power for SRAM2, enable high
- Pull-downy aby zapobiec losowym wyzwalaniem latch-up protection
- (near R18) Input channel 0 for ACMP1 used to monitor SRAM2
- (near H70) Enable for SRAM1, enable low
- (near H70) Enable for SRAM2, enable low
- CAN control pin
- (near R15) FPGA control pin
- Watchdog enable & toggle
- uC: EFM32GG280F1024
  Farnell: 2503901
  Ułożyc na PCB w tym samym miejscu, co w lotnej wersji.
- Title:
- Project:
- Author:
- Model:
- Document Number:
- Checked by:
- Rev:
- Date:
- Approved by:
- Sheet:
- of
- File name:

### Library data of the parts
C11 C13 C14 C16-C18 C27 = CAP: as C5 on sheet OBC_EEPROM; Farnell: 1759122; Supplier Part Number 1: 1759122; Supplier 1: Farnell
C12 C19 C21 = CAP: as C6 on sheet OBC_EEPROM; Farnell: 2320922; Supplier Part Number 1: 2320922; Supplier 1: Farnell
C15 = CAP: Capacitator; Voltage: 25V; Material: X8R; Value: 1uF; Farnell: 2112718; Supplier Part Number 1: 2112718; Supplier 1: Farnell
C20 C22 C25 = CAP: as C26 on sheet OBC_Flash; Farnell: 9406182; Supplier Part Number 1: 9406182; Supplier 1: Farnell
C28-C31 = CAP: Capacitator; Voltage: 50V; Material: NP0; Value: 20pF; Farnell: 2627117; Supplier Part Number 1: 2627117; Supplier 1: Farnell
H4 H12-H14 H21 H26 H35 H47-H49 H69 H70 H86 = Wire_AWG-30: An AWG-30 wire solder point.
LED1-LED5 = LED-1206_RED: LED diode, SMD1206 package.; Supplier 1: Farnell; Farnell: 1581229
  LED1: Value: LED_PD1
  LED2: Value: LED_PD2
  LED3: Value: LED_PD3
  LED4: Value: POWER
  LED5: Value: WDT
R10-R21 = RES: Resistor; Tolerance: 1%; Supplier 1: Farnell
  R10 R11 R13-R16 R19-R21: Farnell: 9330810; Value: 2.2k; Supplier Part Number 1: 9330810
  R12 R17 R18: Farnell: 2446547; Value: 10k; Supplier Part Number 1: 2446547
S1 = SW PUSHBUTTON_0: Button; Manufacturer: Multicomp; Comp Type: SMD; Design: M; Sourcing: Fixed; Value: MC32882; Supplier 1: Farnell; Supplier Part Number 1: 2396053; partNo: MC32882; Pricing: 0,472; Farnell: 2396053; EMS Mounting: M
U5 = EFM32GG280F1024-QFP100: EFM32 Giant Gecko, M3 ARM Cortex CPU, 1024 KB Flash, 128 KB RAM, 1.85 - 3.8 V Supply, 48 MHz Max Speed, -40 to 85 degC, 100-Pin LQFP, RoHS Compliant; Manufacturer: Silicon Labs; Supplier 1: Digi-Key; DigiKey: 914-1061-1-ND; partNo: EFM32GG280F1024-QFP100; HelpUrl: http://www.silabs.com/documents/public/data-sheets/EFM32GG280.pdf
U7 = TPS3824-33DBVT: Voltage Monitor With Watchdog Timer; Manufacturer: Texas Instruments; Supplier 1: Digi-Key; DigiKey: 296-26951-1-ND; partNo: TPS3824-33DBVT; HelpUrl: http://www.ti.com/lit/ds/symlink/tps3828.pdf
XT1 = ABM3B-8.000MHZ-B2-T: Resonator Ceramic; Manufacturer Part Number: ABM3B-48.000MHZ-B2-T; value: 48 MHz; Supplier 1: Farnell; Farnell: 2467815
XT2 = Q13MC30610003: EPSON MC-306 32.768KHZ 12.5pF Crystal; Manufacturer: Epson; ManufacturerPartNumber: Q13MC30610003; Value: 32.768kHz

## Sheet OBC_I2C-Repeater.SchDoc: I2C Repeater
size A4; ApprovedBy: (not approved); CheckedBy: Grzegorz Gajoch; Author: Piotr Kuligowski; DocumentNumber: PWSat2-xxx-DW-xxx; Revision: 2; SheetNumber: 6; SheetTotal: 10; Model: EM
Used 2 times, as channels Top/I2C-Repeater, Top/I2C-Repeater. Parts and nets are listed once, with the designators drawn on the sheet.
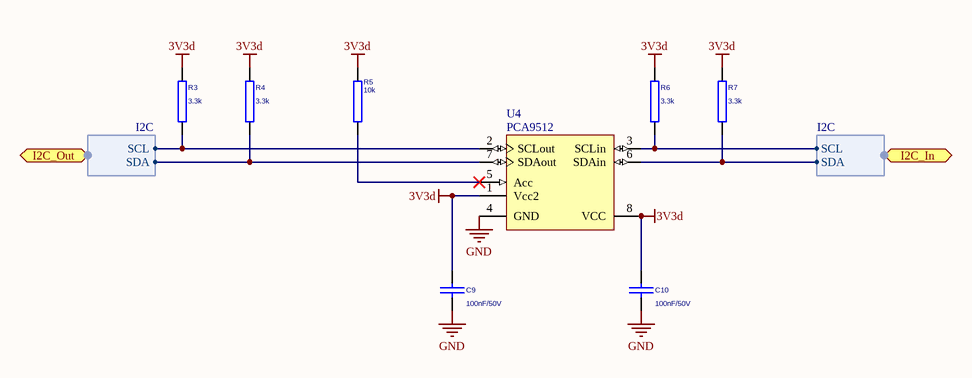
[diagram p6: OBC_I2C-Repeater.SchDoc]

### Parts
C9  100nF/50V  [C0603]
C10  100nF/50V  [C0603]
R3  3.3k  [R0603]
R4  3.3k  [R0603]
R5  10k  [R0603]
R6  3.3k  [R0603]
R7  3.3k  [R0603]
U4  PCA9512  [TSSOP8]

### Ports
I2C_In (harness I2C), I2C_Out (harness I2C)

### Harnesses
I2C: SDA, SCL

### Nets
3V3d: C9.1 C10.1 R3.1 R4.1 R5.2 R6.1 R7.1 U4.1(Vcc2) U4.8(VCC)
GND: C9.2 C10.2 U4.4(GND)
NetR3_2: R3.2 U4.2(SCLout) ; port I2C_Out.SCL
NetR4_2: R4.2 U4.7(SDAout) ; port I2C_Out.SDA
NetR5_1: R5.1 U4.5(Acc)
NetR6_2: R6.2 U4.3(SCLin) ; port I2C_In.SCL
NetR7_2: R7.2 U4.6(SDAin) ; port I2C_In.SDA

### Channels
Top/I2C-Repeater: designators end in _1
Top/I2C-Repeater: designators end in _2

### Notes on the sheet
- Title:
- Project:
- Author:
- Model:
- Document Number:
- Checked by:
- Rev:
- Date:
- Approved by:
- Sheet:
- of
- File name:

### Library data of the parts
C9 C10 = CAP: as C5 on sheet OBC_EEPROM; Farnell: 1759122; Supplier Part Number 1: 1759122; Supplier 1: Farnell
R3-R7 = RES: Resistor; Tolerance: 1%; Supplier 1: Farnell
  R3 R4 R6 R7: Farnell: 2446676; Value: 3.3k; Supplier Part Number 1: 2446676
  R5: Farnell: 2446547; Value: 10k; Supplier Part Number 1: 2446547
U4 = PCA9512: Level shifting hot swappable  I  2C and SMBus buffer; Manufacturer: Texas Instruments; partNo: PCA9512DP; Supplier 1: Digi-Key; DigiKey: 568-1907-1-ND

## Sheet OBC_EBI_D-Latch.SchDoc: EBI / D-Latch
size A4; ApprovedBy: (not approved); CheckedBy: Grzegorz Gajoch; Author: Piotr Kuligowski; DocumentNumber: PWSat2-xxx-DW-xxx; Revision: 2; SheetNumber: 7; SheetTotal: 10; Model: EM
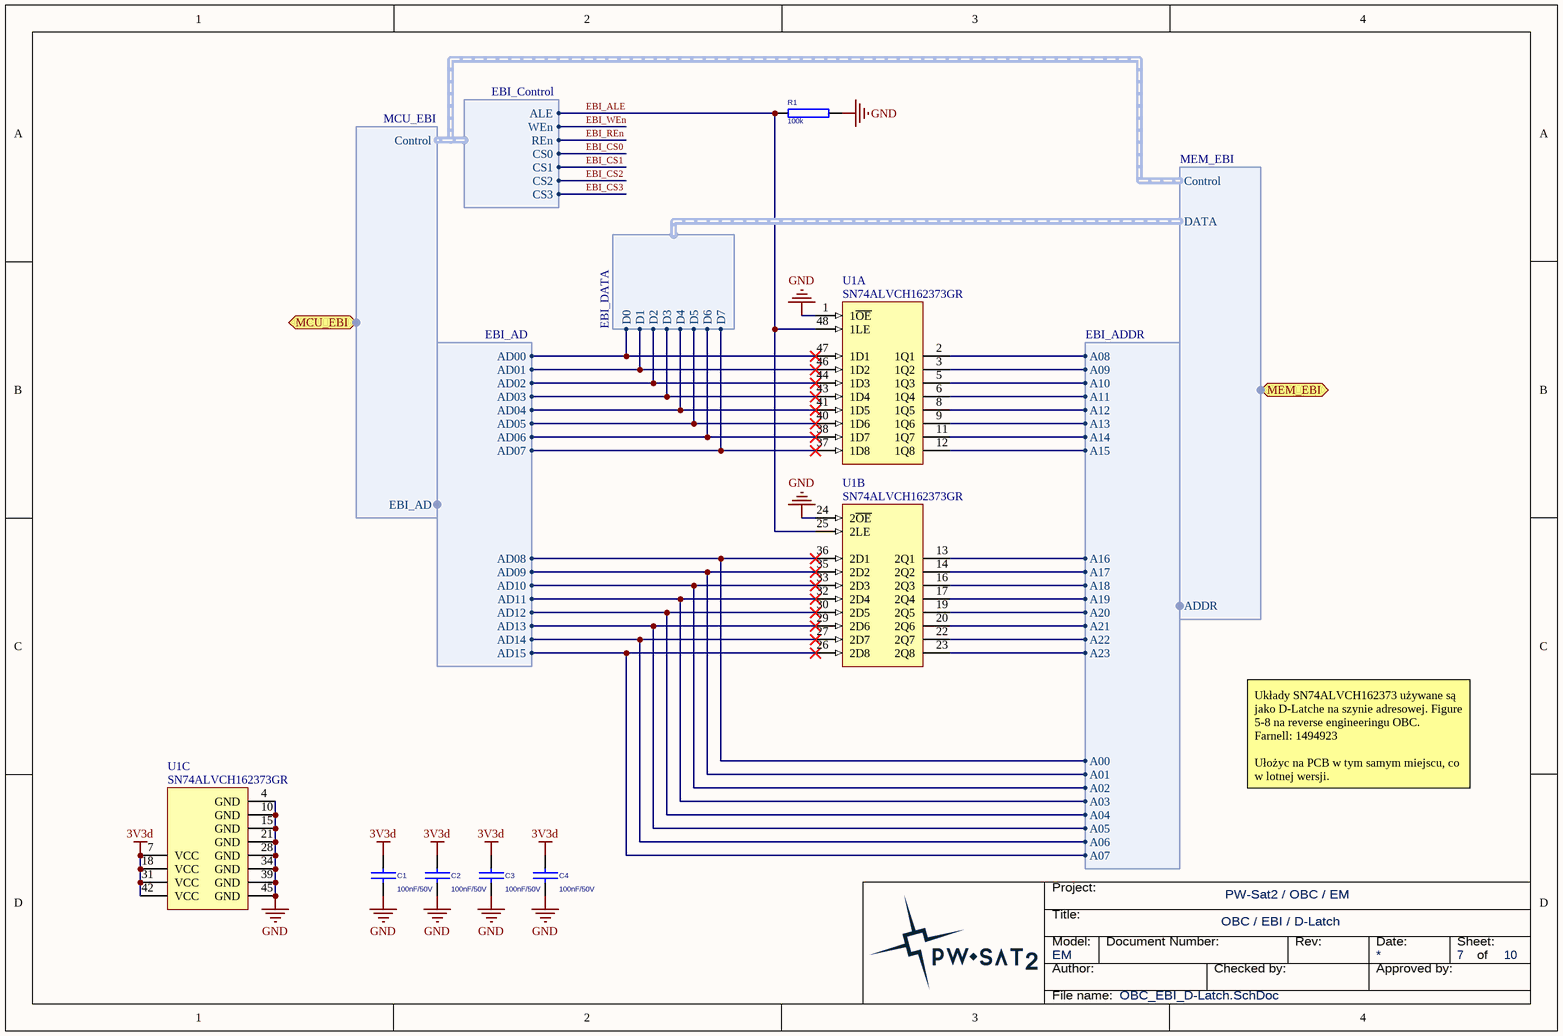
[diagram p7: OBC_EBI_D-Latch.SchDoc]

### Parts
C1  100nF/50V  [C0603]
C2  100nF/50V  [C0603]
C3  100nF/50V  [C0603]
C4  100nF/50V  [C0603]
R1  100k  [R0603]
U1  SN74ALVCH162373GR  [DGG0048A_N]  (parts A,B,C of 3)

### Ports
MCU_EBI (harness MCU_EBI), MEM_EBI (harness MEM_EBI)

### Harnesses
MCU_EBI: EBI_AD, Control
EBI_AD: AD00, AD01, AD02, AD03, AD04, AD05, AD06, AD07, AD09, AD10, AD11, AD12, AD13, AD14, AD15, AD08
MEM_EBI: DATA, ADDR, Control
EBI_ADDR: A09, A10, A11, A12, A13, A14, A15, A08, A16, A17, A18, A19, A20, A21, A22, A23, A00, A01, A02, A03, A04, A05, A06, A07
EBI_Control: ALE, WEn, REn, CS0, CS1, CS2, CS3
EBI_DATA: D6, D5, D4, D3, D2, D1, D0, D7

### Nets
3V3d: C1.1 C2.1 C3.1 C4.1 U1.7(VCC) U1.18(VCC) U1.31(VCC) U1.42(VCC)
GND: C1.2 C2.2 C3.2 C4.2 R1.1 U1.1(1~{OE}) U1.4(GND) U1.10(GND) U1.15(GND) U1.21(GND) U1.24(2~{OE}) U1.28(GND) U1.34(GND) U1.39(GND) U1.45(GND)
EBI_A00: U1.36(2D1) ; harness EBI_AD.AD08, harness EBI_ADDR.A00
EBI_A01: U1.35(2D2) ; harness EBI_AD.AD09, harness EBI_ADDR.A01
EBI_A02: U1.33(2D3) ; harness EBI_AD.AD10, harness EBI_ADDR.A02
EBI_A03: U1.32(2D4) ; harness EBI_AD.AD11, harness EBI_ADDR.A03
EBI_A04: U1.30(2D5) ; harness EBI_AD.AD12, harness EBI_ADDR.A04
EBI_A05: U1.29(2D6) ; harness EBI_AD.AD13, harness EBI_ADDR.A05
EBI_A06: U1.27(2D7) ; harness EBI_AD.AD14, harness EBI_ADDR.A06
EBI_A07: U1.26(2D8) ; harness EBI_AD.AD15, harness EBI_ADDR.A07
EBI_A08: U1.2(1Q1) ; harness EBI_ADDR.A08
EBI_A09: U1.3(1Q2) ; harness EBI_ADDR.A09
EBI_A10: U1.5(1Q3) ; harness EBI_ADDR.A10
EBI_A11: U1.6(1Q4) ; harness EBI_ADDR.A11
EBI_A12: U1.8(1Q5) ; harness EBI_ADDR.A12
EBI_A13: U1.9(1Q6) ; harness EBI_ADDR.A13
EBI_A14: U1.11(1Q7) ; harness EBI_ADDR.A14
EBI_A15: U1.12(1Q8) ; harness EBI_ADDR.A15
EBI_A16: U1.13(2Q1) ; harness EBI_ADDR.A16
EBI_A17: U1.14(2Q2) ; harness EBI_ADDR.A17
EBI_A18: U1.16(2Q3) ; harness EBI_ADDR.A18
EBI_A19: U1.17(2Q4) ; harness EBI_ADDR.A19
EBI_A20: U1.19(2Q5) ; harness EBI_ADDR.A20
EBI_A21: U1.20(2Q6) ; harness EBI_ADDR.A21
EBI_A22: U1.22(2Q7) ; harness EBI_ADDR.A22
EBI_A23: U1.23(2Q8) ; harness EBI_ADDR.A23
EBI_AD00: U1.47(1D1) ; harness EBI_AD.AD00, harness EBI_DATA.D0
EBI_AD01: U1.46(1D2) ; harness EBI_AD.AD01, harness EBI_DATA.D1
EBI_AD02: U1.44(1D3) ; harness EBI_AD.AD02, harness EBI_DATA.D2
EBI_AD03: U1.43(1D4) ; harness EBI_AD.AD03, harness EBI_DATA.D3
EBI_AD04: U1.41(1D5) ; harness EBI_AD.AD04, harness EBI_DATA.D4
EBI_AD05: U1.40(1D6) ; harness EBI_AD.AD05, harness EBI_DATA.D5
EBI_AD06: U1.38(1D7) ; harness EBI_AD.AD06, harness EBI_DATA.D6
EBI_AD07: U1.37(1D8) ; harness EBI_AD.AD07, harness EBI_DATA.D7
EBI_ALE: R1.2 U1.25(2LE) U1.48(1LE) ; harness EBI_Control.ALE

### Notes on the sheet
- Układy SN74ALVCH162373 używane są jako D-Latche na szynie adresowej. Figure 5-8 na reverse engineeringu OBC.
  Farnell: 1494923
  Ułożyc na PCB w tym samym miejscu, co w lotnej wersji.
- Title:
- Project:
- Author:
- Model:
- Document Number:
- Checked by:
- Rev:
- Date:
- Approved by:
- Sheet:
- of
- File name:

### Library data of the parts
C1-C4 = CAP: as C5 on sheet OBC_EEPROM; Farnell: 1759122; Supplier Part Number 1: 1759122; Supplier 1: Farnell
R1 = RES: Resistor; Tolerance: 1%; Farnell: 9330402; Value: 100k; Supplier Part Number 1: 9330402; Supplier 1: Farnell
U1 = SN74ALVCH162373GR: 16-Bit Transparent D-Type Latch with 3-State Outputs, DGG0048A, LARGE T&R; Manufacturer: Texas Instruments; Supplier 1: Digi-Key; DigiKey: 296-18538-1-ND; partNo: SN74ALVCH162373GR

## Sheet OBC_Connectors_Piggyback.SchDoc: Connectors / Piggyback
size A4; ApprovedBy: (not approved); CheckedBy: Grzegorz Gajoch; Author: Piotr Kuligowski; DocumentNumber: PWSat2-xxx-DW-xxx; Revision: 2; SheetNumber: 2; SheetTotal: 10; Model: EM
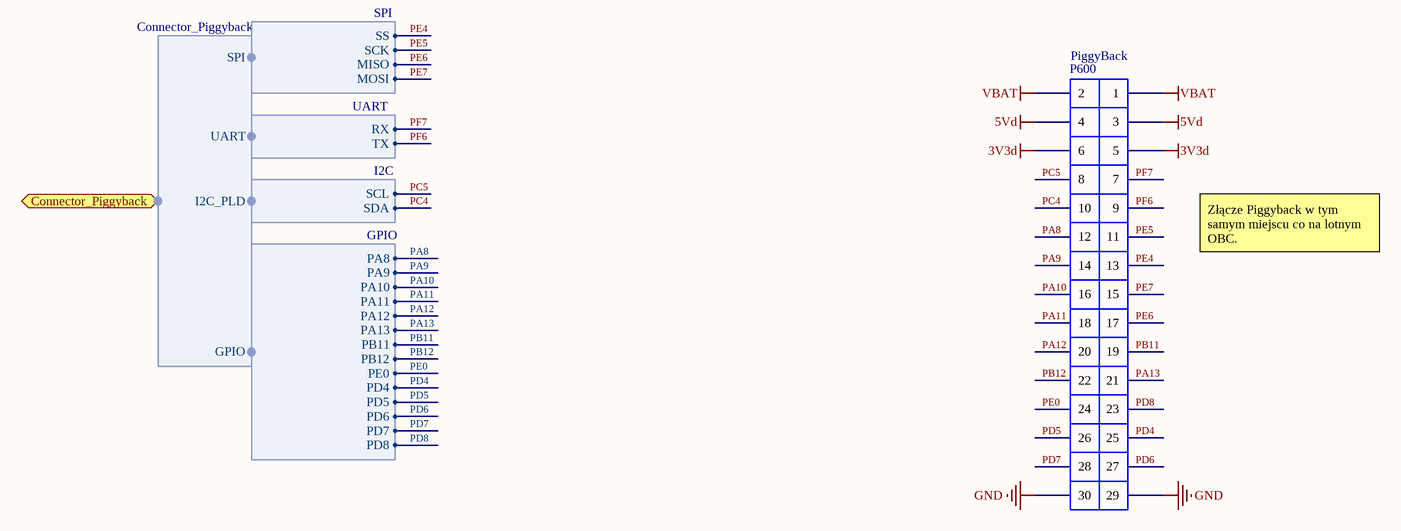
[diagram p8: OBC_Connectors_Piggyback.SchDoc]

### Parts
P600  PiggyBack  [Samtec_CES-115-01-L-D]

### Ports
Connector_Piggyback (harness Connector_Piggyback)

### Harnesses
Connector_Piggyback: UART, SPI, I2C_PLD, GPIO
I2C: SDA, SCL
UART: RX, TX
SPI: MISO, MOSI, SCK, SS
GPIO: PA8, PA9, PA10, PA11, PA12, PA13, PB11, PB12, PE0, PD4, PD5, PD6, PD7, PD8

### Nets
3V3d: P600.5 P600.6
5Vd: P600.3 P600.4
GND: P600.29 P600.30
VBAT: P600.1 P600.2
PA8: P600.12 ; harness GPIO.PA8  [project net GPIO_PA8]
PA9: P600.14 ; harness GPIO.PA9  [project net GPIO_PA9]
PA10: P600.16 ; harness GPIO.PA10  [project net GPIO_PA10]
PA11: P600.18 ; harness GPIO.PA11  [project net GPIO_PA11]
PA12: P600.20 ; harness GPIO.PA12  [project net GPIO_PA12]
PA13: P600.21 ; harness GPIO.PA13  [project net GPIO_PA13]
PB11: P600.19 ; harness GPIO.PB11  [project net GPIO_PB11]
PB12: P600.22 ; harness GPIO.PB12  [project net GPIO_PB12]
PC4: P600.10 ; harness I2C.SDA  [project net PC-104_I2C-Payload_SDA]
PC5: P600.8 ; harness I2C.SCL  [project net PC-104_I2C-Payload_SCL]
PD4: P600.25 ; harness GPIO.PD4  [project net GPIO_PD4]
PD5: P600.26 ; harness GPIO.PD5  [project net GPIO_PD5]
PD6: P600.27 ; harness GPIO.PD6  [project net GPIO_PD6]
PD7: P600.28 ; harness GPIO.PD7  [project net GPIO_PD7]
PD8: P600.23 ; harness GPIO.PD8  [project net GPIO_PD8]
PE0: P600.24 ; harness GPIO.PE0  [project net GPIO_PE0]
PE4: P600.13 ; harness SPI.SS
PE5: P600.11 ; harness SPI.SCK
PE6: P600.17 ; harness SPI.MISO
PE7: P600.15 ; harness SPI.MOSI
PF6: P600.9 ; harness UART.TX
PF7: P600.7 ; harness UART.RX

### Notes on the sheet
- Złącze Piggyback w tym samym miejscu co na lotnym OBC.
- Title:
- Project:
- Author:
- Model:
- Document Number:
- Checked by:
- Rev:
- Date:
- Approved by:
- Sheet:
- of
- File name:

### Library data of the parts
P600 = Samtec_CES-115-xx-x-D: Low Profile Socket Strips; partNo: CES-115-01-G-D; Manufacturer: Samtec; HelpUrl: http://suddendocs.samtec.com/catalog_english/slw.pdf; Value: PiggyBack; Supplier 1: Farnell; Farnell: 1806463

## Sheet OBC_Connectors_PC-104.SchDoc: Connectors / PC-104
size A4; ApprovedBy: (not approved); CheckedBy: Grzegorz Gajoch; Author: Piotr Kuligowski; DocumentNumber: PWSat2-xxx-DW-xxx; Revision: 2; SheetNumber: 3; SheetTotal: 10; Model: EM
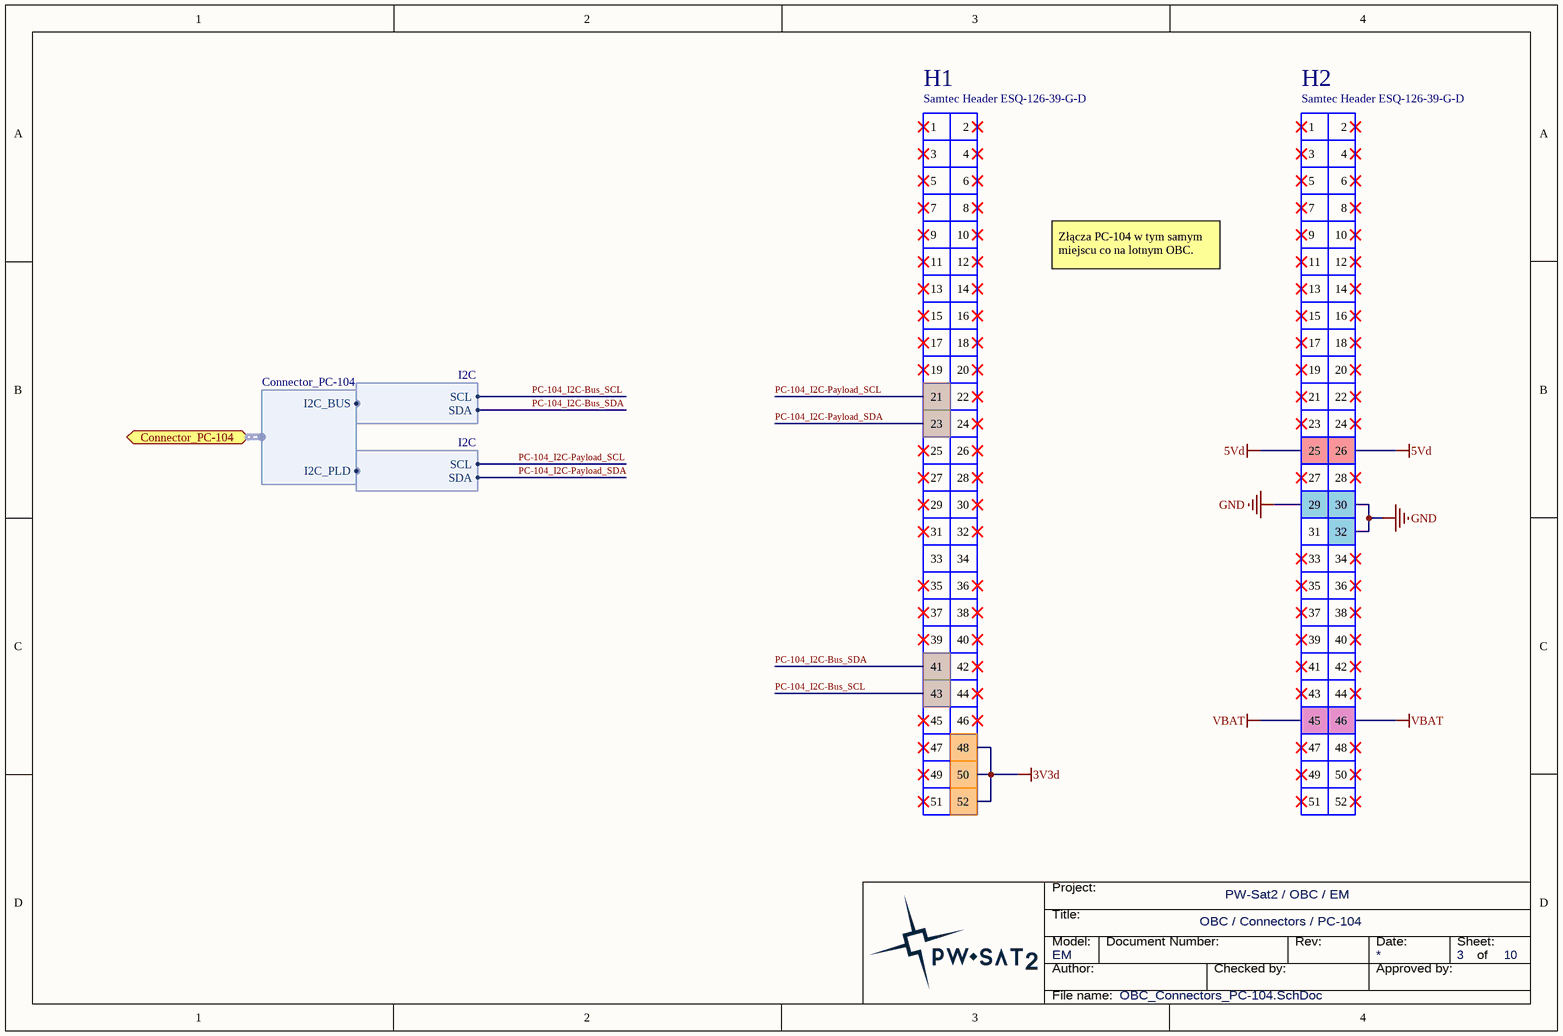
[diagram p9: OBC_Connectors_PC-104.SchDoc]

### Parts
H1  Samtec Header ESQ-126-39-G-D  [SAMTEC_ESQ-126-39-G-D]
H2  Samtec Header ESQ-126-39-G-D  [SAMTEC_ESQ-126-39-G-D]

### Ports
Connector_PC-104 (harness Connector_PC-104)

### Harnesses
I2C: SDA, SCL
Connector_PC-104: I2C_BUS, I2C_PLD

### Nets
3V3d: H1.48 H1.50 H1.52
5Vd: H2.25 H2.26
GND: H2.29 H2.30 H2.32
VBAT: H2.45 H2.46
PC-104_I2C-Bus_SCL: H1.43 ; harness I2C.SCL
PC-104_I2C-Bus_SDA: H1.41 ; harness I2C.SDA
PC-104_I2C-Payload_SCL: H1.21 ; harness I2C.SCL
PC-104_I2C-Payload_SDA: H1.23 ; harness I2C.SDA

Not connected (* = marked no-connect by the designer): H1 1* 2* 3* 4* 5* 6* 7* 8* 9* 10* 11* 12* 13* 14* 15* 16* 17* 18* 19* 20* 22* 24* 25* 26* 27* 28* 29* 30* 31* 32* 33 34 35* 36* 37* 38* 39* 40* 42* 44* 45* 46* 47* 49* 51*; H2 1* 2* 3* 4* 5* 6* 7* 8* 9* 10* 11* 12* 13* 14* 15* 16* 17* 18* 19* 20* 21* 22* 23* 24* 27* 28* 31 33* 34* 35* 36* 37* 38* 39* 40* 41* 42* 43* 44* 47* 48* 49* 50* 51* 52*

### Notes on the sheet
- Złącza PC-104 w tym samym miejscu co na lotnym OBC.
- Title:
- Project:
- Author:
- Model:
- Document Number:
- Checked by:
- Rev:
- Date:
- Approved by:
- Sheet:
- of
- File name:

### Library data of the parts
H1 H2 = Samtec_ESQ-126-xx-x-D: Samtec ESQ Series Header , 2.54mm pitch, 2x26pin. PC-104 Stack Connector.; partNo: ESQ-126-39-G-D; Supplier 1: Digi-Key; Digi-Key: SAM8772-ND; Manufacturer: Samtec; Comment_1: Samtec Header ESQ-126-39-G-D

## Nets that join several sheets
3V3d: OBC_Connectors (P1.25 P3.1 P100.1), OBC_EEPROM (C5.1 C6.1 U2.7), OBC_Flash (C7.1 C8.1 R2.2 U3.37), OBC_SRAM (C23.1 C24.1 U6.12 U6.37), OBC_MCU (23 pins), Top/I2C-Repeater (9 pins), Top/I2C-Repeater (9 pins), OBC_EBI_D-Latch (8 pins), OBC_Connectors_Piggyback (P600.5 P600.6), OBC_Connectors_PC-104 (H1.48 H1.50 H1.52)
5Vd: OBC_Connectors_Piggyback (P600.3 P600.4), OBC_Connectors_PC-104 (H2.25 H2.26)
GND: OBC_Connectors (14 pins), OBC_EEPROM (C5.2 C6.2 U2.21), OBC_Flash (6 pins), OBC_SRAM (7 pins), OBC_MCU (37 pins), Top/I2C-Repeater (C9_1.2 C10_1.2 U4_1.4), Top/I2C-Repeater (C9_2.2 C10_2.2 U4_2.4), OBC_EBI_D-Latch (15 pins), OBC_Connectors_Piggyback (P600.29 P600.30), OBC_Connectors_PC-104 (H2.29 H2.30 H2.32)
VBAT: OBC_Connectors_Piggyback (P600.1 P600.2), OBC_Connectors_PC-104 (H2.45 H2.46)
DBG_PB0: OBC_Connectors (P1.2), OBC_MCU (U5.9)
DBG_PB1: OBC_Connectors (P1.4), OBC_MCU (U5.10)
DBG_PB2: OBC_Connectors (P1.6), OBC_MCU (U5.11)
DBG_PC0: OBC_Connectors (P1.1), OBC_MCU (U5.18)
DBG_PC1: OBC_Connectors (P1.3), OBC_MCU (U5.19)
DBG_PC2: OBC_Connectors (P1.5), OBC_MCU (R17.1 U5.20)
DBG_PC8: OBC_Connectors (P1.7), OBC_MCU (R18.1 U5.68)
DBG_PC11: OBC_Connectors (P1.9), OBC_MCU (U5.71)
DBG_PC12: OBC_Connectors (P1.11), OBC_MCU (U5.72)
DBG_PC13: OBC_Connectors (P1.13), OBC_MCU (U5.73)
DBG_PC14: OBC_Connectors (P1.15), OBC_MCU (U5.74)
DBG_PC15: OBC_Connectors (P1.17), OBC_MCU (U5.75)
DBG_PE2: OBC_Connectors (P1.21), OBC_MCU (U5.62)
DBG_PE3: OBC_Connectors (P1.23), OBC_MCU (U5.63)
DBG_PF9: OBC_Connectors (P1.19), OBC_MCU (R11.2 R12.2 U5.87)
EBI_A00: OBC_EEPROM (U2.17), OBC_Flash (U3.45), OBC_SRAM (U6.45), OBC_MCU (U5.100), OBC_EBI_D-Latch (U1.36)
EBI_A01: OBC_EEPROM (U2.16), OBC_Flash (U3.25), OBC_SRAM (U6.25), OBC_MCU (U5.1), OBC_EBI_D-Latch (U1.35)
EBI_A02: OBC_EEPROM (U2.15), OBC_Flash (U3.24), OBC_SRAM (U6.24), OBC_MCU (U5.2), OBC_EBI_D-Latch (U1.33)
EBI_A03: OBC_EEPROM (U2.14), OBC_Flash (U3.23), OBC_SRAM (U6.23), OBC_MCU (U5.3), OBC_EBI_D-Latch (U1.32)
EBI_A04: OBC_EEPROM (U2.13), OBC_Flash (U3.22), OBC_SRAM (U6.22), OBC_MCU (U5.4), OBC_EBI_D-Latch (U1.30)
EBI_A05: OBC_EEPROM (U2.12), OBC_Flash (U3.21), OBC_SRAM (U6.21), OBC_MCU (U5.5), OBC_EBI_D-Latch (U1.29)
EBI_A06: OBC_EEPROM (U2.11), OBC_Flash (U3.20), OBC_SRAM (U6.20), OBC_MCU (U5.6), OBC_EBI_D-Latch (U1.27)
EBI_A07: OBC_EEPROM (U2.10), OBC_Flash (U3.19), OBC_SRAM (U6.19), OBC_MCU (U5.7), OBC_EBI_D-Latch (U1.26)
EBI_A08: OBC_EEPROM (U2.4), OBC_Flash (U3.18), OBC_SRAM (U6.18), OBC_EBI_D-Latch (U1.2)
EBI_A09: OBC_EEPROM (U2.3), OBC_Flash (U3.8), OBC_SRAM (U6.8), OBC_EBI_D-Latch (U1.3)
EBI_A10: OBC_EEPROM (U2.28), OBC_Flash (U3.7), OBC_SRAM (U6.7), OBC_EBI_D-Latch (U1.5)
EBI_A11: OBC_EEPROM (U2.2), OBC_Flash (U3.6), OBC_SRAM (U6.6), OBC_EBI_D-Latch (U1.6)
EBI_A12: OBC_EEPROM (U2.9), OBC_Flash (U3.5), OBC_SRAM (U6.5), OBC_EBI_D-Latch (U1.8)
EBI_A13: OBC_EEPROM (U2.5), OBC_Flash (U3.4), OBC_SRAM (U6.4), OBC_EBI_D-Latch (U1.9)
EBI_A14: OBC_EEPROM (U2.8), OBC_Flash (U3.3), OBC_SRAM (U6.3), OBC_EBI_D-Latch (U1.11)
EBI_A15: OBC_Flash (U3.2), OBC_SRAM (U6.2), OBC_EBI_D-Latch (U1.12)
EBI_A16: OBC_Flash (U3.1), OBC_SRAM (U6.1), OBC_EBI_D-Latch (U1.13)
EBI_A17: OBC_Flash (U3.48), OBC_SRAM (U6.48), OBC_EBI_D-Latch (U1.14)
EBI_A18: OBC_Flash (U3.17), OBC_SRAM (U6.17), OBC_EBI_D-Latch (U1.16)
EBI_A19: OBC_Flash (U3.16), OBC_SRAM (U6.16), OBC_EBI_D-Latch (U1.17)
EBI_A20: OBC_Flash (U3.9), OBC_SRAM (U6.9), OBC_EBI_D-Latch (U1.19)
EBI_A21: OBC_Flash (U3.10), OBC_EBI_D-Latch (U1.20)
EBI_AD00: OBC_EEPROM (U2.18), OBC_Flash (U3.29), OBC_SRAM (U6.29), OBC_MCU (U5.92), OBC_EBI_D-Latch (U1.47)
EBI_AD01: OBC_EEPROM (U2.19), OBC_Flash (U3.31), OBC_SRAM (U6.31), OBC_MCU (U5.93), OBC_EBI_D-Latch (U1.46)
EBI_AD02: OBC_EEPROM (U2.20), OBC_Flash (U3.33), OBC_SRAM (U6.33), OBC_MCU (U5.94), OBC_EBI_D-Latch (U1.44)
EBI_AD03: OBC_EEPROM (U2.22), OBC_Flash (U3.35), OBC_SRAM (U6.35), OBC_MCU (U5.95), OBC_EBI_D-Latch (U1.43)
EBI_AD04: OBC_EEPROM (U2.23), OBC_Flash (U3.38), OBC_SRAM (U6.38), OBC_MCU (U5.96), OBC_EBI_D-Latch (U1.41)
EBI_AD05: OBC_EEPROM (U2.24), OBC_Flash (U3.40), OBC_SRAM (U6.40), OBC_MCU (U5.97), OBC_EBI_D-Latch (U1.40)
EBI_AD06: OBC_EEPROM (U2.25), OBC_Flash (U3.42), OBC_SRAM (U6.42), OBC_MCU (U5.98), OBC_EBI_D-Latch (U1.38)
EBI_AD07: OBC_EEPROM (U2.26), OBC_Flash (U3.44), OBC_SRAM (U6.44), OBC_MCU (U5.99), OBC_EBI_D-Latch (U1.37)
EBI_ALE: OBC_Connectors (P1.8), OBC_MCU (U5.79), OBC_EBI_D-Latch (R1.2 U1.25 U1.48)
EBI_CS0: OBC_Connectors (P1.14), OBC_EEPROM (U2.27), OBC_MCU (U5.88)
EBI_CS1: OBC_Connectors (P1.16), OBC_Flash (U3.26), OBC_MCU (U5.89)
EBI_CS2: OBC_Connectors (P1.18), OBC_SRAM (U6.26), OBC_MCU (U5.90)
EBI_CS3: OBC_Connectors (P1.20), OBC_MCU (U5.91)
EBI_REn: OBC_Connectors (P1.12), OBC_EEPROM (U2.1), OBC_Flash (U3.28), OBC_SRAM (U6.28), OBC_MCU (U5.81)
EBI_WEn: OBC_Connectors (P1.10), OBC_EEPROM (U2.6), OBC_Flash (U3.11), OBC_SRAM (U6.11), OBC_MCU (U5.80)
GPIO_PA8: OBC_MCU (U5.27), OBC_Connectors_Piggyback (P600.12)
GPIO_PA9: OBC_MCU (U5.28), OBC_Connectors_Piggyback (P600.14)
GPIO_PA10: OBC_MCU (U5.29), OBC_Connectors_Piggyback (P600.16)
GPIO_PA11: OBC_MCU (U5.30), OBC_Connectors_Piggyback (P600.18)
GPIO_PA12: OBC_MCU (U5.33), OBC_Connectors_Piggyback (P600.20)
GPIO_PA13: OBC_MCU (U5.34), OBC_Connectors_Piggyback (P600.21)
GPIO_PB11: OBC_MCU (U5.39), OBC_Connectors_Piggyback (P600.19)
GPIO_PB12: OBC_MCU (U5.40), OBC_Connectors_Piggyback (P600.22)
GPIO_PD4: OBC_MCU (U5.50), OBC_Connectors_Piggyback (P600.25)
GPIO_PD5: OBC_MCU (U5.51), OBC_Connectors_Piggyback (P600.26)
GPIO_PD6: OBC_MCU (U5.52), OBC_Connectors_Piggyback (P600.27)
GPIO_PD7: OBC_MCU (U5.53), OBC_Connectors_Piggyback (P600.28)
GPIO_PD8: OBC_Connectors (P4.2), OBC_MCU (U5.54), OBC_Connectors_Piggyback (P600.23)
GPIO_PE0: OBC_MCU (U5.60), OBC_Connectors_Piggyback (P600.24)
I2C0_SCL: OBC_MCU (U5.56), Top/I2C-Repeater (R6_2.2 U4_2.3)
I2C0_SDA: OBC_MCU (U5.55), Top/I2C-Repeater (R7_2.2 U4_2.6)
I2C1_SCL: OBC_MCU (U5.23), Top/I2C-Repeater (R6_1.2 U4_1.3)
I2C1_SDA: OBC_MCU (U5.22), Top/I2C-Repeater (R7_1.2 U4_1.6)
Intergation_PB6: OBC_Connectors (P3.6), OBC_MCU (U5.15)
Intergation_PD0: OBC_Connectors (P3.8), OBC_MCU (U5.46)
Intergation_PE1: OBC_Connectors (P3.10), OBC_MCU (U5.61)
MCU_~{RESET}: OBC_Connectors (P1.22 P3.12 P100.15), OBC_MCU (5 pins)
MCU_SWCLK: OBC_Connectors (P100.9), OBC_MCU (U5.76)
MCU_SWDIO: OBC_Connectors (P100.7), OBC_MCU (U5.77)
MCU_SWO: OBC_Connectors (P100.13), OBC_MCU (U5.78)
NetP4_1: OBC_Connectors (P4.1), OBC_MCU (R20.2)
NetP4_3: OBC_Connectors (P4.3), OBC_MCU (R21.1)
NetP500_1: OBC_Connectors (P500.1), OBC_MCU (R11.1)
PC-104_I2C-Bus_SCL: OBC_Connectors (P3.5), Top/I2C-Repeater (R3_2.2 U4_2.2), OBC_Connectors_PC-104 (H1.43)
PC-104_I2C-Bus_SDA: OBC_Connectors (P3.3), Top/I2C-Repeater (R4_2.2 U4_2.7), OBC_Connectors_PC-104 (H1.41)
PC-104_I2C-Payload_SCL: OBC_Connectors (P3.9), Top/I2C-Repeater (R3_1.2 U4_1.2), OBC_Connectors_Piggyback (P600.8), OBC_Connectors_PC-104 (H1.21)
PC-104_I2C-Payload_SDA: OBC_Connectors (P3.7), Top/I2C-Repeater (R4_1.2 U4_1.7), OBC_Connectors_Piggyback (P600.10), OBC_Connectors_PC-104 (H1.23)
PE4: OBC_MCU (U5.64), OBC_Connectors_Piggyback (P600.13)
PE5: OBC_MCU (U5.65), OBC_Connectors_Piggyback (P600.11)
PE6: OBC_MCU (U5.66), OBC_Connectors_Piggyback (P600.17)
PE7: OBC_MCU (U5.67), OBC_Connectors_Piggyback (P600.15)
PF6: OBC_MCU (U5.84), OBC_Connectors_Piggyback (P600.9)
PF7: OBC_MCU (U5.85), OBC_Connectors_Piggyback (P600.7)
U1_RX: OBC_Connectors (P3.4 P101.2), OBC_MCU (U5.38)
U1_TX: OBC_Connectors (P3.2 P101.1), OBC_MCU (U5.37)